# EAGLE design Devi (EAGLE 7.6.0)
CNAME: OffGrid-Devices Devi; CREVISION: B; DESIGNER: Tiago Angelo
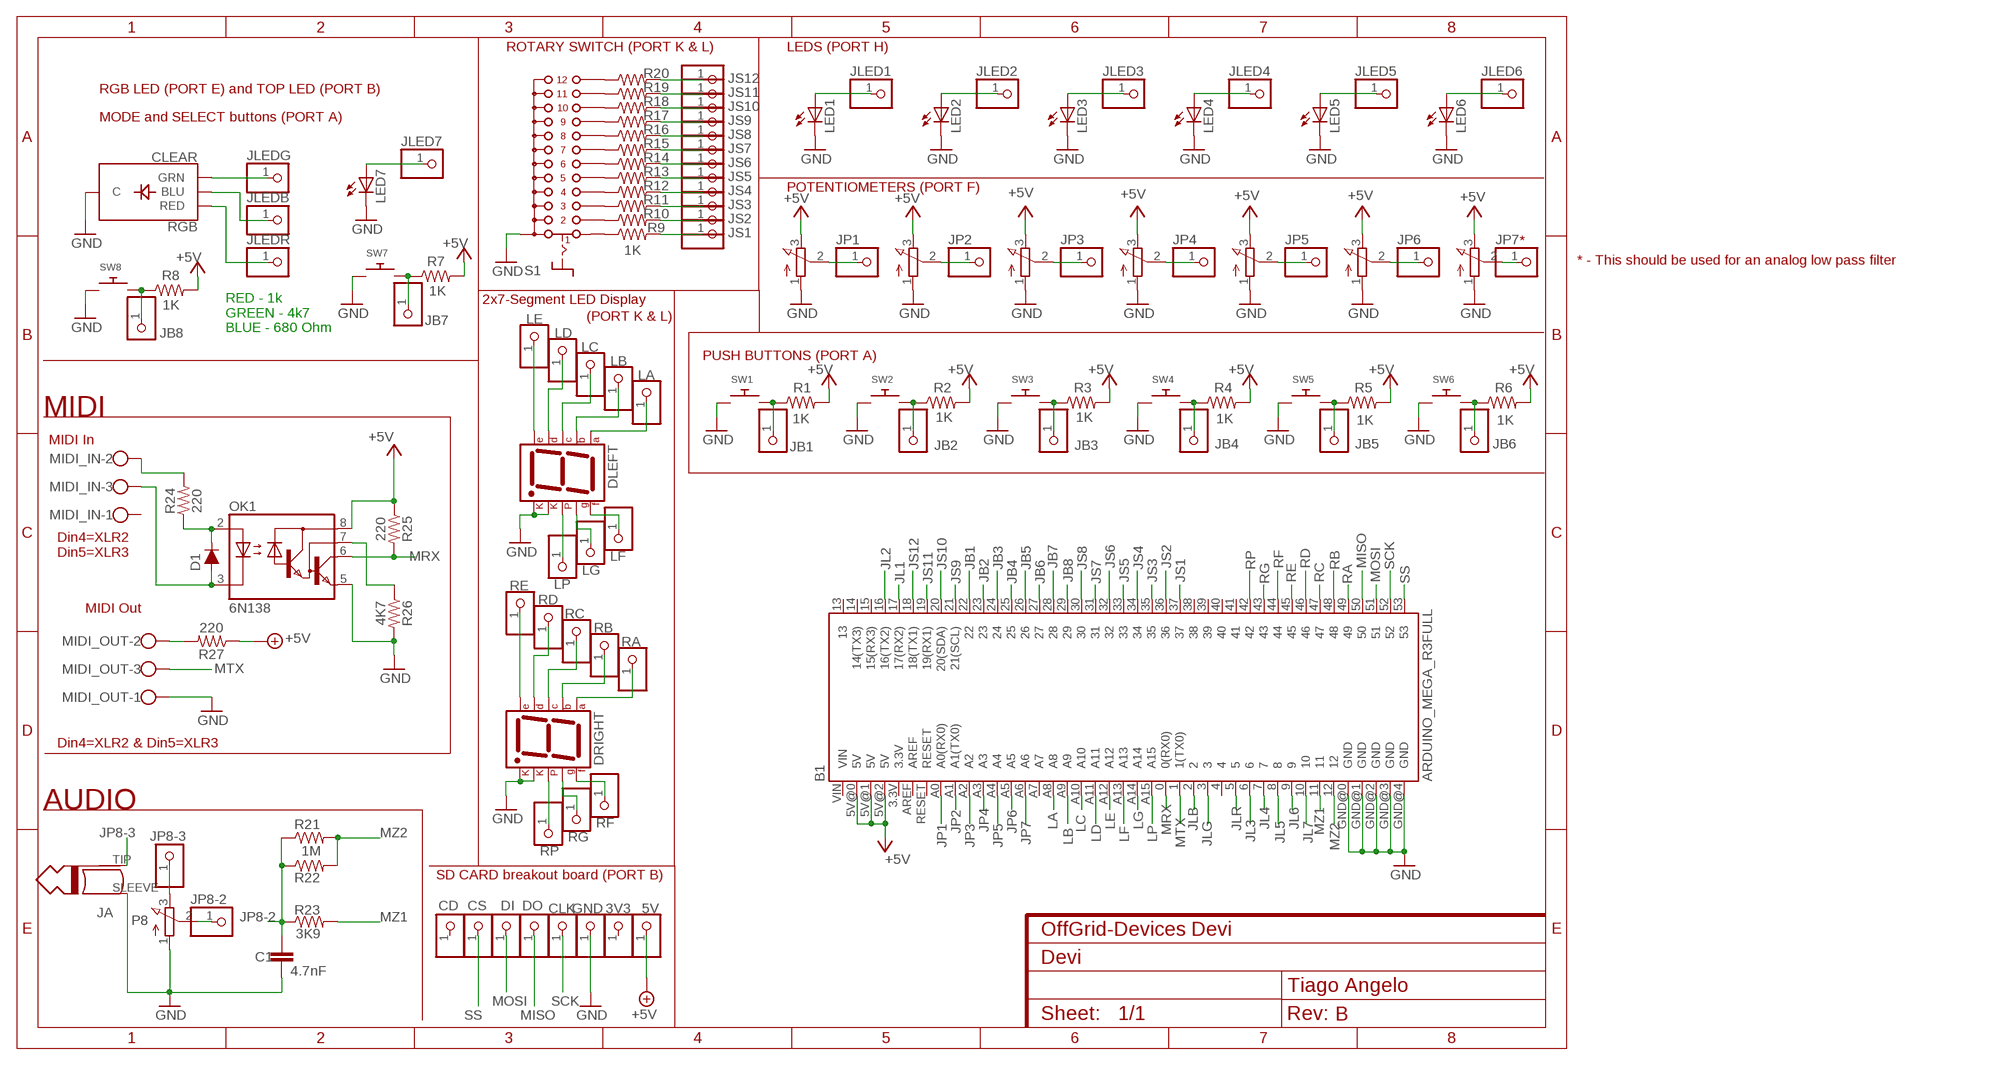
[diagram p0: schematic, sheet 1]

## Parts
3V3  PINHD-1X1CB  [1X01-CLEANBIG]
5V  PINHD-1X1CB  [1X01-CLEANBIG]
B1  ARDUINO_MEGA_R3FULL  [ARDUINO_MEGA]
C1  4.7nF  C-EU050-025X075  [C050-025X075]
CD  PINHD-1X1CB  [1X01-CLEANBIG]
CLK  PINHD-1X1CB  [1X01-CLEANBIG]
CS  PINHD-1X1CB  [1X01-CLEANBIG]
D1  200mA/100V/1V  DIODE-1N4148  [DIODE-1N4148]
DI  PINHD-1X1CB  [1X01-CLEANBIG]
DLEFT  7SEG-CK  [7SEG-13]
DO  PINHD-1X1CB  [1X01-CLEANBIG]
DRIGHT  7SEG-CK  [7SEG-13]
GND  PINHD-1X1CB  [1X01-CLEANBIG]
JA  MONO_PLUG  [TWO_PADS]
JB1  PINHD-1X1CB  [1X01-CLEANBIG]
JB2  PINHD-1X1CB  [1X01-CLEANBIG]
JB3  PINHD-1X1CB  [1X01-CLEANBIG]
JB4  PINHD-1X1CB  [1X01-CLEANBIG]
JB5  PINHD-1X1CB  [1X01-CLEANBIG]
JB6  PINHD-1X1CB  [1X01-CLEANBIG]
JB7  PINHD-1X1CB  [1X01-CLEANBIG]
JB8  PINHD-1X1CB  [1X01-CLEANBIG]
JLED1  PINHD-1X1CB  [1X01-CLEANBIG]
JLED2  PINHD-1X1CB  [1X01-CLEANBIG]
JLED3  PINHD-1X1CB  [1X01-CLEANBIG]
JLED4  PINHD-1X1CB  [1X01-CLEANBIG]
JLED5  PINHD-1X1CB  [1X01-CLEANBIG]
JLED6  PINHD-1X1CB  [1X01-CLEANBIG]
JLED7  PINHD-1X1CB  [1X01-CLEANBIG]
JLEDB  PINHD-1X1CB  [1X01-CLEANBIG]
JLEDG  PINHD-1X1CB  [1X01-CLEANBIG]
JLEDR  PINHD-1X1CB  [1X01-CLEANBIG]
JP1  PINHD-1X1CB  [1X01-CLEANBIG]
JP2  PINHD-1X1CB  [1X01-CLEANBIG]
JP3  PINHD-1X1CB  [1X01-CLEANBIG]
JP4  PINHD-1X1CB  [1X01-CLEANBIG]
JP5  PINHD-1X1CB  [1X01-CLEANBIG]
JP6  PINHD-1X1CB  [1X01-CLEANBIG]
JP7  PINHD-1X1CB  [1X01-CLEANBIG]
JP8-2  PINHD-1X1CB  [1X01-CLEANBIG]
JP8-3  PINHD-1X1CB  [1X01-CLEANBIG]
JS1  PINHD-1X1CB  [1X01-CLEANBIG]
JS2  PINHD-1X1CB  [1X01-CLEANBIG]
JS3  PINHD-1X1CB  [1X01-CLEANBIG]
JS4  PINHD-1X1CB  [1X01-CLEANBIG]
JS5  PINHD-1X1CB  [1X01-CLEANBIG]
JS6  PINHD-1X1CB  [1X01-CLEANBIG]
JS7  PINHD-1X1CB  [1X01-CLEANBIG]
JS8  PINHD-1X1CB  [1X01-CLEANBIG]
JS9  PINHD-1X1CB  [1X01-CLEANBIG]
JS10  PINHD-1X1CB  [1X01-CLEANBIG]
JS11  PINHD-1X1CB  [1X01-CLEANBIG]
JS12  PINHD-1X1CB  [1X01-CLEANBIG]
LA  PINHD-1X1CB  [1X01-CLEANBIG]
LB  PINHD-1X1CB  [1X01-CLEANBIG]
LC  PINHD-1X1CB  [1X01-CLEANBIG]
LD  PINHD-1X1CB  [1X01-CLEANBIG]
LE  PINHD-1X1CB  [1X01-CLEANBIG]
LED1  LED3MM  [LED3MM]
LED2  LED3MM  [LED3MM]
LED3  LED3MM  [LED3MM]
LED4  LED3MM  [LED3MM]
LED5  LED3MM  [LED3MM]
LED6  LED3MM  [LED3MM]
LED7  LED3MM  [LED3MM]
LF  PINHD-1X1CB  [1X01-CLEANBIG]
LG  PINHD-1X1CB  [1X01-CLEANBIG]
LP  PINHD-1X1CB  [1X01-CLEANBIG]
MIDI_IN  W237-103  [W237-103]
MIDI_OUT  W237-103  [W237-103]
OK1  6N138  [DIL08]
P1  3RP/1610N  [3RP/1610N]
P2  3RP/1610N  [3RP/1610N]
P3  3RP/1610N  [3RP/1610N]
P4  3RP/1610N  [3RP/1610N]
P5  3RP/1610N  [3RP/1610N]
P6  3RP/1610N  [3RP/1610N]
P7  3RP/1610N  [3RP/1610N]
P8  3RP/1610N  [3RP/1610N]
R1  1K  1KOHM-HORIZ-1/4W-5%  [AXIAL-0.3]
R2  1K  1KOHM-HORIZ-1/4W-5%  [AXIAL-0.3]
R3  1K  1KOHM-HORIZ-1/4W-5%  [AXIAL-0.3]
R4  1K  1KOHM-HORIZ-1/4W-5%  [AXIAL-0.3]
R5  1K  1KOHM-HORIZ-1/4W-5%  [AXIAL-0.3]
R6  1K  1KOHM-HORIZ-1/4W-5%  [AXIAL-0.3]
R7  1K  1KOHM-HORIZ-1/4W-5%  [AXIAL-0.3]
R8  1K  1KOHM-HORIZ-1/4W-5%  [AXIAL-0.3]
R9  1K  1KOHM-HORIZ-1/4W-5%  [AXIAL-0.3]
R10  1K  1KOHM-HORIZ-1/4W-5%  [AXIAL-0.3]
R11  1K  1KOHM-HORIZ-1/4W-5%  [AXIAL-0.3]
R12  1K  1KOHM-HORIZ-1/4W-5%  [AXIAL-0.3]
R13  1K  1KOHM-HORIZ-1/4W-5%  [AXIAL-0.3]
R14  1K  1KOHM-HORIZ-1/4W-5%  [AXIAL-0.3]
R15  1K  1KOHM-HORIZ-1/4W-5%  [AXIAL-0.3]
R16  1K  1KOHM-HORIZ-1/4W-5%  [AXIAL-0.3]
R17  1K  1KOHM-HORIZ-1/4W-5%  [AXIAL-0.3]
R18  1K  1KOHM-HORIZ-1/4W-5%  [AXIAL-0.3]
R19  1K  1KOHM-HORIZ-1/4W-5%  [AXIAL-0.3]
R20  1K  1KOHM-HORIZ-1/4W-5%  [AXIAL-0.3]
R21  1M  1KOHM-HORIZ-1/4W-5%  [AXIAL-0.3]
R22  1M  1KOHM-HORIZ-1/4W-5%  [AXIAL-0.3]
R23  3K9  1KOHM-HORIZ-1/4W-5%  [AXIAL-0.3]
R24  220  1KOHM-HORIZ-1/4W-5%  [AXIAL-0.3]
R25  220  1KOHM-HORIZ-1/4W-5%  [AXIAL-0.3]
R26  4K7  1KOHM-HORIZ-1/4W-5%  [AXIAL-0.3]
R27  220  1KOHM-HORIZ-1/4W-5%  [AXIAL-0.3]
RA  PINHD-1X1CB  [1X01-CLEANBIG]
RB  PINHD-1X1CB  [1X01-CLEANBIG]
RC  PINHD-1X1CB  [1X01-CLEANBIG]
RD  PINHD-1X1CB  [1X01-CLEANBIG]
RE  PINHD-1X1CB  [1X01-CLEANBIG]
RF  PINHD-1X1CB  [1X01-CLEANBIG]
RG  PINHD-1X1CB  [1X01-CLEANBIG]
RGB  CLEAR  LED-RGB-CCCLEAR  [LED-RGB-THRU]
RP  PINHD-1X1CB  [1X01-CLEANBIG]
S1  CK101X12  [CK101X12]
SW1  SWITCH_PUSHBUTTONEVQ-PE  [TACT_PANA-EVQ]
SW2  SWITCH_PUSHBUTTONEVQ-PE  [TACT_PANA-EVQ]
SW3  SWITCH_PUSHBUTTONEVQ-PE  [TACT_PANA-EVQ]
SW4  SWITCH_PUSHBUTTONEVQ-PE  [TACT_PANA-EVQ]
SW5  SWITCH_PUSHBUTTONEVQ-PE  [TACT_PANA-EVQ]
SW6  SWITCH_PUSHBUTTONEVQ-PE  [TACT_PANA-EVQ]
SW7  SWITCH_PUSHBUTTONEVQ-PE  [TACT_PANA-EVQ]
SW8  SWITCH_PUSHBUTTONEVQ-PE  [TACT_PANA-EVQ]

## Nets
+5V: 5V.1 B1.5V@0(5V) B1.5V@1(5V) B1.5V@2(5V) OK1.8(VCC) P1.3(E) P2.3(E) P3.3(E) P4.3(E) P5.3(E) P6.3(E) P7.3(E) R1.P$2 R2.P$2 R3.P$2 R4.P$2 R5.P$2 R6.P$2 R7.P$2 R8.P$2 R25.P$1 R27.P$1
GND: B1.GND@0(GND) B1.GND@1(GND) B1.GND@2(GND) B1.GND@3(GND) B1.GND@4(GND) C1.2 DLEFT.3(CK1) DLEFT.8(CK2) DRIGHT.3(CK1) DRIGHT.8(CK2) GND.1 JA.SLEEVE LED1.K(C) LED2.K(C) LED3.K(C) LED4.K(C) LED5.K(C) LED6.K(C) LED7.K(C) MIDI_OUT.1 OK1.5(GND) P1.1(A) P2.1(A) P3.1(A) P4.1(A) P5.1(A) P6.1(A) P7.1(A) P8.1(A) R26.P$2 RGB.2(C) S1.A SW1.P$1 SW2.P$1 SW3.P$1 SW4.P$1 SW5.P$1 SW6.P$1 SW7.P$1 SW8.P$1
JB1: B1.22 JB1.1 R1.P$1 SW1.P$2
JB2: B1.23 JB2.1 R2.P$1 SW2.P$2
JB3: B1.24 JB3.1 R3.P$1 SW3.P$2
JB4: B1.25 JB4.1 R4.P$1 SW4.P$2
JB5: B1.26 JB5.1 R5.P$1 SW5.P$2
JB6: B1.27 JB6.1 R6.P$1 SW6.P$2
JB7: B1.28 JB7.1 R7.P$1 SW7.P$2
JB8: B1.29 JB8.1 R8.P$1 SW8.P$2
JL1: B1.17(17(RX2)) JLED1.1 LED1.A
JL2: B1.16(16(TX2)) JLED2.1 LED2.A
JL3: B1.6 JLED3.1 LED3.A
JL4: B1.7 JLED4.1 LED4.A
JL5: B1.8 JLED5.1 LED5.A
JL6: B1.9 JLED6.1 LED6.A
JL7: B1.10 JLED7.1 LED7.A
JLB: B1.2 JLEDB.1 RGB.4(BLU)
JLG: B1.3 JLEDG.1 RGB.3(GRN)
JLR: B1.5 JLEDR.1 RGB.1(RED)
JP1: B1.A0(A0(RX0)) JP1.1 P1.2(S)
JP2: B1.A1(A1(TX0)) JP2.1 P2.2(S)
JP3: B1.A2 JP3.1 P3.2(S)
JP4: B1.A3 JP4.1 P4.2(S)
JP5: B1.A4 JP5.1 P5.2(S)
JP6: B1.A5 JP6.1 P6.2(S)
JP7: B1.A6 JP7.1 P7.2(S)
JP8-2: C1.1 JP8-2.1 P8.2(S) R21.P$1 R22.P$1 R23.P$1
JP8-3: JA.TIP JP8-3.1 P8.3(E)
JS1: B1.37 JS1.1 R9.P$2
JS2: B1.36 JS2.1 R10.P$2
JS3: B1.35 JS3.1 R11.P$2
JS4: B1.34 JS4.1 R12.P$2
JS5: B1.33 JS5.1 R13.P$2
JS6: B1.32 JS6.1 R14.P$2
JS7: B1.31 JS7.1 R15.P$2
JS8: B1.30 JS8.1 R16.P$2
JS9: B1.21(21(SCL)) JS9.1 R17.P$2
JS10: B1.20(20(SDA)) JS10.1 R18.P$2
JS11: B1.19(19(RX1)) JS11.1 R19.P$2
JS12: B1.18(18(TX1)) JS12.1 R20.P$2
LA: B1.A8 DLEFT.7(A) LA.1
LB: B1.A9 DLEFT.6(B) LB.1
LC: B1.A10 DLEFT.4(C) LC.1
LD: B1.A11 DLEFT.2(D) LD.1
LE: B1.A12 DLEFT.1(E) LE.1
LF: B1.A13 DLEFT.9(F) LF.1
LG: B1.A14 DLEFT.10(G) LG.1
LP: B1.A15 DLEFT.5(DP) LP.1
MISO: B1.50 DO.1
MOSI: B1.51 DI.1
MRX: B1.0(0(RX0)) OK1.6(VO) R25.P$2
MTX: B1.1(1(TX0)) MIDI_OUT.3
MZ1: B1.11 R23.P$2
MZ2: B1.12 R21.P$2 R22.P$2
N$2: R9.P$1 S1.1
N$3: R10.P$1 S1.2
N$4: R11.P$1 S1.3
N$5: R12.P$1 S1.4
N$6: R13.P$1 S1.5
N$7: R14.P$1 S1.6
N$8: R15.P$1 S1.7
N$9: R16.P$1 S1.8
N$10: R17.P$1 S1.9
N$11: R18.P$1 S1.10
N$12: R19.P$1 S1.11
N$13: R20.P$1 S1.12
N$25: D1.A MIDI_IN.3 OK1.3(C)
N$28: D1.C OK1.2(A) R24.P$1
N$29: MIDI_IN.2 R24.P$2
N$30: OK1.7(VB) R26.P$1
N$31: MIDI_OUT.2 R27.P$2
RA: B1.49 DRIGHT.7(A) RA.1
RB: B1.48 DRIGHT.6(B) RB.1
RC: B1.47 DRIGHT.4(C) RC.1
RD: B1.46 DRIGHT.2(D) RD.1
RE: B1.45 DRIGHT.1(E) RE.1
RF: B1.44 DRIGHT.9(F) RF.1
RG: B1.43 DRIGHT.10(G) RG.1
RP: B1.42 DRIGHT.5(DP) RP.1
SCK: B1.52 CLK.1
SS: B1.53 CS.1
Unconnected: 3V3.1 B1.3.3V B1.4 B1.13 B1.14(14(TX3)) B1.15(15(RX3)) B1.38 B1.39 B1.40 B1.41 B1.A7 B1.AREF B1.RESET B1.VIN CD.1 MIDI_IN.1

## Notes on the sheet
- ROTARY SWITCH (PORT K & L) | LEDS (PORT H)
- RGB LED (PORT E) and TOP LED (PORT B)
- MODE and SELECT buttons (PORT A)
- POTENTIOMETERS (PORT F)
- *
- * - This should be used for an analog low pass filter
- 2x7-Segment LED Display
- (PORT K & L)
- RED - 1k
  GREEN - 4k7 
  BLUE - 680 Ohm
- PUSH BUTTONS (PORT A)
- MIDI
- MIDI In
- Din4=XLR2 
  Din5=XLR3
- MIDI Out
- Din4=XLR2 & Din5=XLR3
- AUDIO
- SD CARD breakout board (PORT B)

## Library data of the parts
3V3 5V CD CLK CS DI DO GND JB1-JB8 JLED1-JLED7 JLEDB JLEDG JLEDR JP1-JP7 JP8-2 JP8-3 JS1-JS12 LA LB LC LD LE LF LG LP RA RB RC RD RE RF RG RP = adafruit:PINHD-1X1: Pin header 1x1 for 0.1" spacing With round pins
B1 = offgrid-devices:ARDUINO_MEGA_R3: Arduino Mega R3 ATmega2560 R3 compatible footprint. SparkFun Products: Arduino Mega 2560 R3 <https://www.sparkfun.com/products/11061>
C1 = rcl:C-EU: CAPACITOR, European symbol
D1 = SparkFun-DiscreteSemi:DIODE: Diode These are standard reverse protection diodes and small signal diodes. SparkFun Products: SparkFun SparkPunk Sound Kit <https://www.sparkfun.com/products/11177> SparkFun ESP8266 Thing <https://www.sparkfun.com/products/13231>; PROD_ID: DIO-08378
DLEFT DRIGHT = special:7SEG-CK: 7-segment DISPLAY single cathode, 13 mm
JA = gm-jacks:MONO_PLUG
LED1-LED7 = led:LED: LED OSRAM: - CHIPLED LG R971, LG N971, LY N971, LG Q971, LY Q971, LO R971, LY R971 LH N974, LH R974 LS Q976, LO Q976, LY Q976 LO Q996 - Hyper CHIPLED LW Q18S LB Q993, LB Q99A, LB R99A - SideLED LS A670, LO A670, LY A670, LG A670, LP A670 LB A673, LV A673, LT A673, LW A673 LH A674 LY A675 LS A676, LA A676, LO A676, LY A676, LW A676 LS A679, LY A679, LG A679 - Hyper Micro SIDELED® LS Y876, LA Y876, LO Y876, LY Y876 LT Y87S - SmartLED LW L88C, LW L88S LB L89C, LB L89S, LG L890 LS L89K, LO L89K, LY L89K LS L896, LA L896, LO L896, LY L896 - TOPLED LS T670, LO T670, LY T670, LG T670, LP T670 LSG T670, LSP T670, LSY T670, LOP T670, LYG T670 LG T671, LOG T671, LSG T671 LB T673, LV T673, LT T673, LW T673 LH T674 LS T676, LA T676, LO T676, LY T676, LB T676, LH T676, LSB T676, LW T676 LB T67C, LV T67C, LT T67C, LS T67K, LO T67K, LY T67K, LW E67C LS E67B, LA E67B, LO E67B, LY E67B, LB E67C, LV E67C, LT E67C LW T67C LS T679, LY T679, LG T679 LS T770, LO T770, LY T770, LG T770, LP T770 LB T773, LV T773, LT T773, LW T773 LH T774 LS E675, LA E675, LY E675, LS T675 LS T776, LA T776, LO T776, LY T776, LB T776 LHGB T686 LT T68C, LB T68C - Hyper Mini TOPLED® LB M676 - Mini TOPLED Santana® LG M470 LS M47K, LO M47K, LY M47K Source: http://www.osram.convergy.de LUXEON: - LUMILED® LXK2-PW12-R00, LXK2-PW12-S00, LXK2-PW14-U00, LXK2-PW14-V00 LXK2-PM12-R00, LXK2-PM12-S00, LXK2-PM14-U00 LXK2-PE12-Q00, LXK2-PE12-R00, LXK2-PE12-S00, LXK2-PE14-T00, LXK2-PE14-U00 LXK2-PB12-K00, LXK2-PB12-L00, LXK2-PB12-M00, LXK2-PB14-N00, LXK2-PB14-P00, LXK2-PB14-Q00 LXK2-PR12-L00, LXK2-PR12-M00, LXK2-PR14-Q00, LXK2-PR14-R00 LXK2-PD12-Q00, LXK2-PD12-R00, LXK2-PD12-S00 LXK2-PH12-R00, LXK2-PH12-S00 LXK2-PL12-P00, LXK2-PL12-Q00, LXK2-PL12-R00 Source: www.luxeon.com KINGBRIGHT: KA-3528ASYC Source: www.kingbright.com
MIDI_IN MIDI_OUT = con-wago-500:W237-103: WAGO SCREW CLAMP; MPN: 237-103; OC_FARNELL: unknown; OC_NEWARK: 18M7116
OK1 = optocoupler:6N138: MOTOROLA OPTO COUPLER; MF: VISHAY/TELEFUNKEN; MPN: 6N138; OC_FARNELL: 9860150; OC_NEWARK: 35K5294
P1-P8 = pot:3RP/1610N: 16mm Potentiometer one level Source: http://www.alphapotentiometers.net/html/16mm_pot_2.html
R1-R27 = SparkFun-Resistors:1KOHM: 1kΩ resistor A resistor is a passive two-terminal electrical component that implements electrical resistance as a circuit element. Resistors act to reduce current flow, and, at the same time, act to lower voltage levels within circuits. - Wikipedia; PROD_ID: RES-08380; VALUE: 1k
RGB = SparkFun-LED:LED-RGB-CC: LED-RGB Common Cathode Packages: LED RGB-THRU LED_PIRANHA_5MM SparkFun Products: RGB Diffused Common Cathode- Diffuse <[https://www.sparkfun.com/products/9264]> RGB Diffused Common Cathode - Clear <[https://www.sparkfun.com/products/105]> LED-RGB 5mm Square (Piranha) <[https://www.sparkfun.com/products/11679]>; PROD_ID: DIO-08418
S1 = switch:CK101X12: ROTARY SWITCH C&K
SW1-SW8 = adafruit:SWITCH_PUSHBUTTON: Buttons SOFTTOUCHSMD_SJ - Soft touch temporary push button (Super Junk Akihabara) Compatible with SKPMANE010 [Mouser: 688-SKPMAN] C&K_KSS = Digikey: KSS221GLFS

## Net classes
0 default: width 0.508 mm, drill 0.508 mm, clearance 0.406 mm
1 GND: width 1.016 mm, drill 0.508 mm, clearance 0.508 mm

## Board
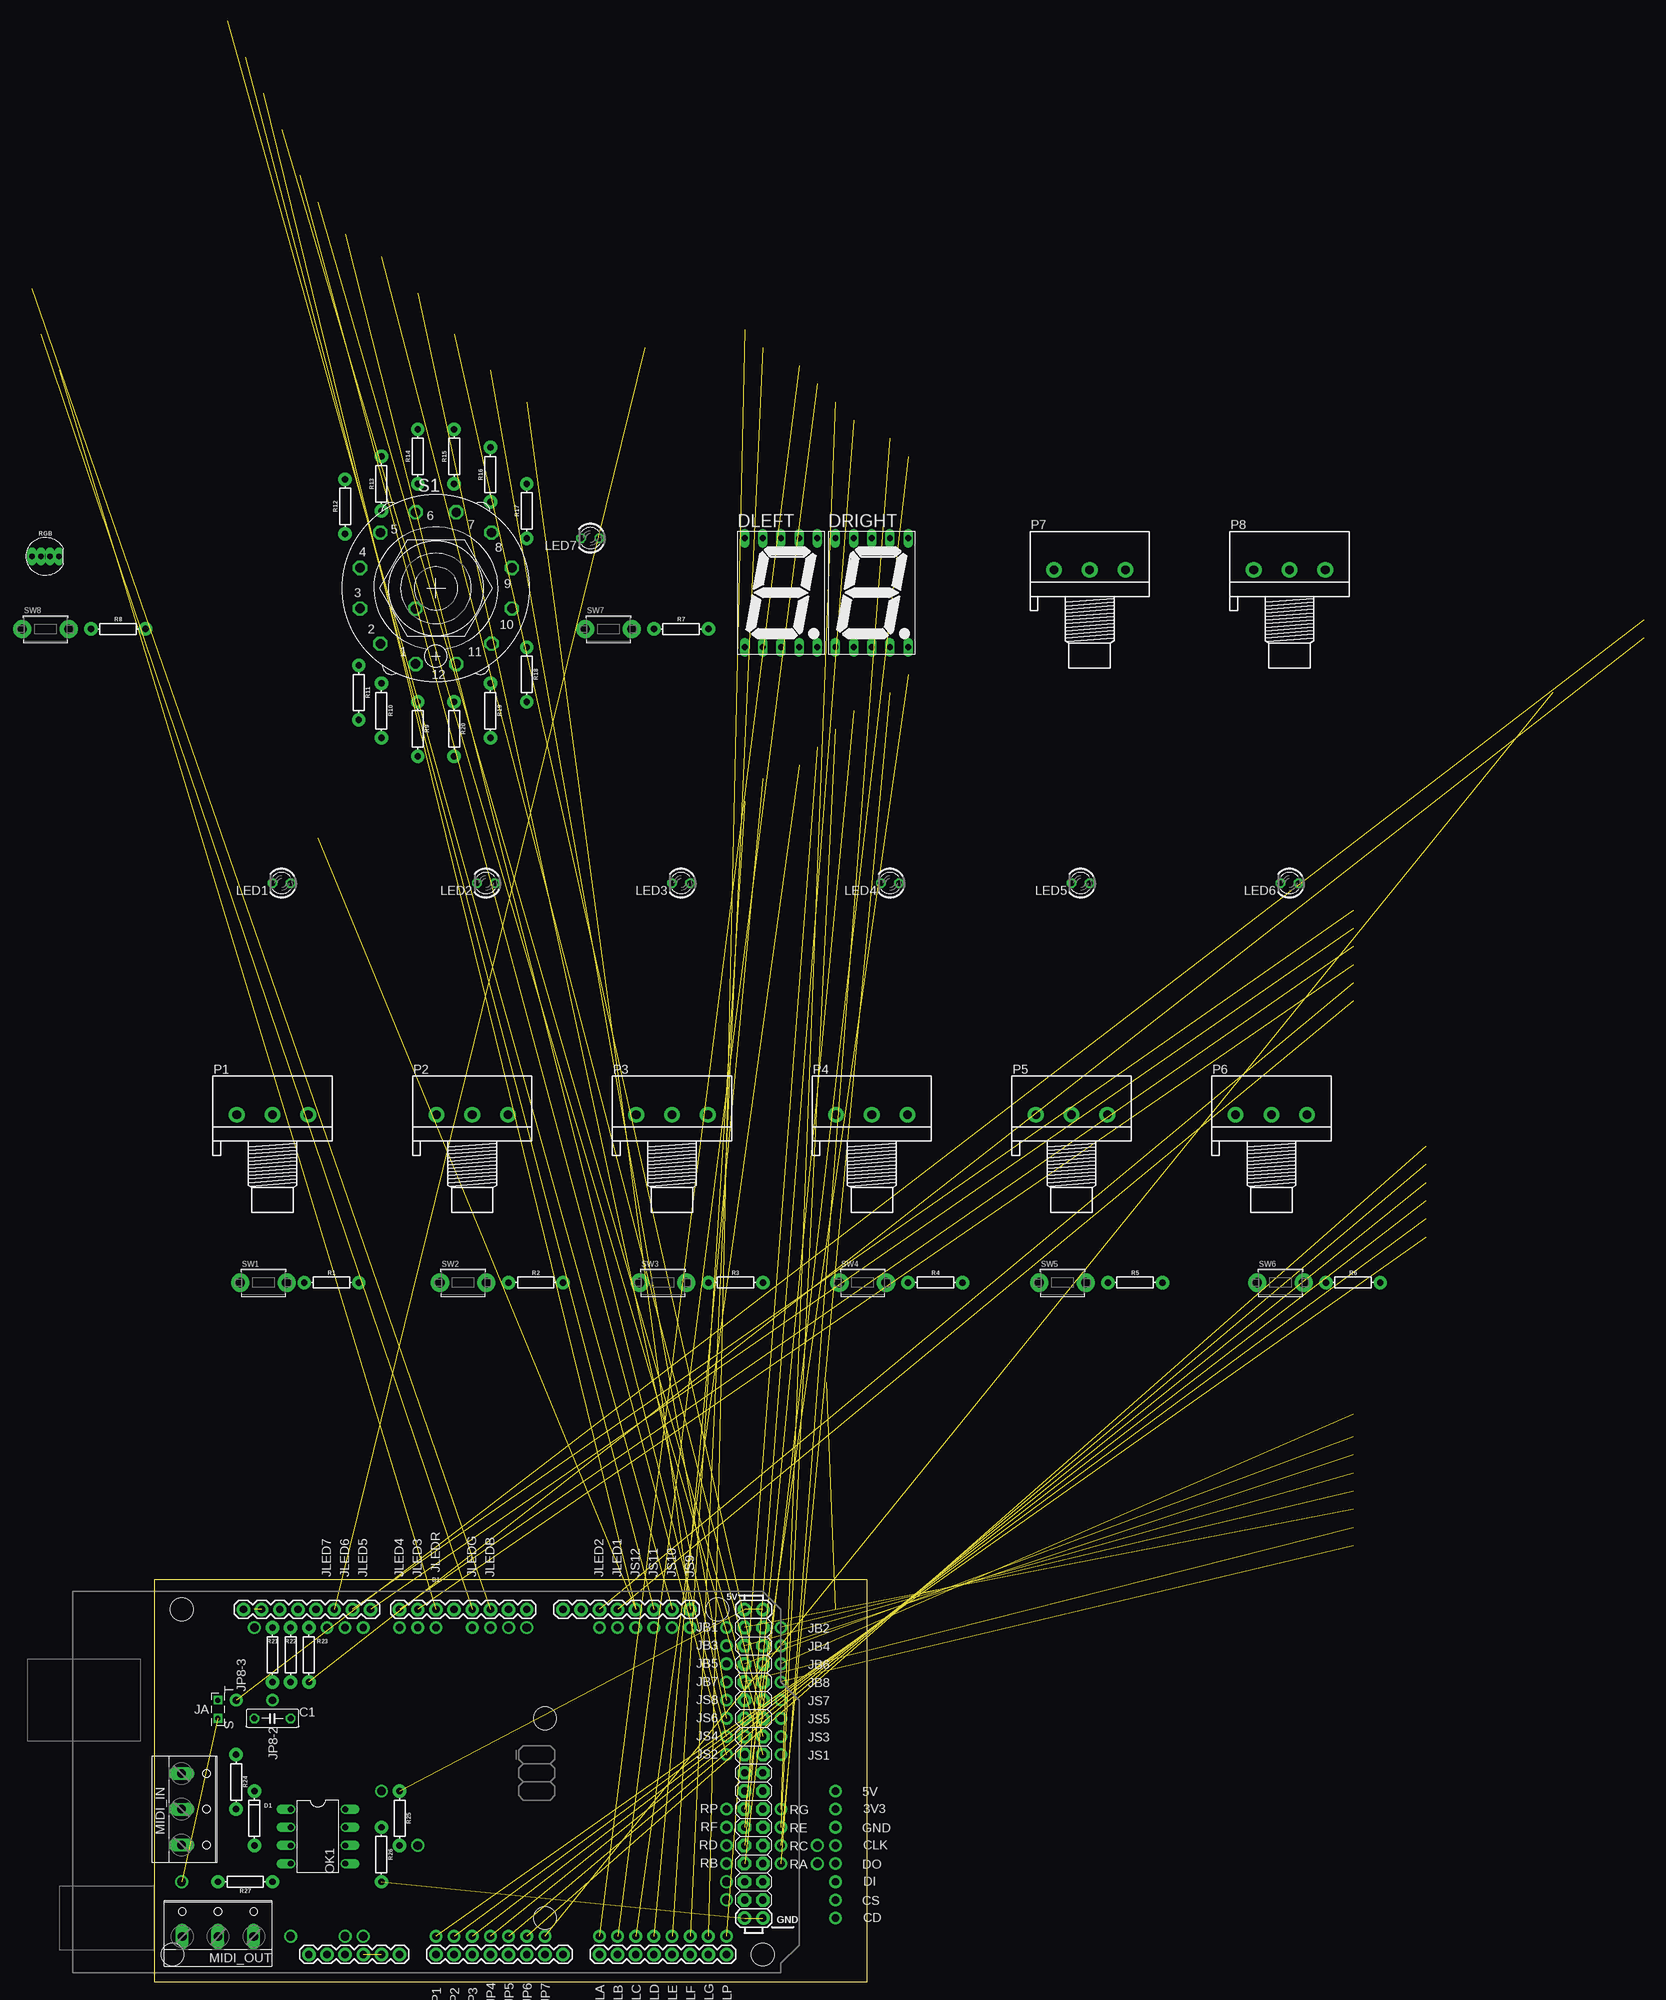
[diagram p1: board, top side]
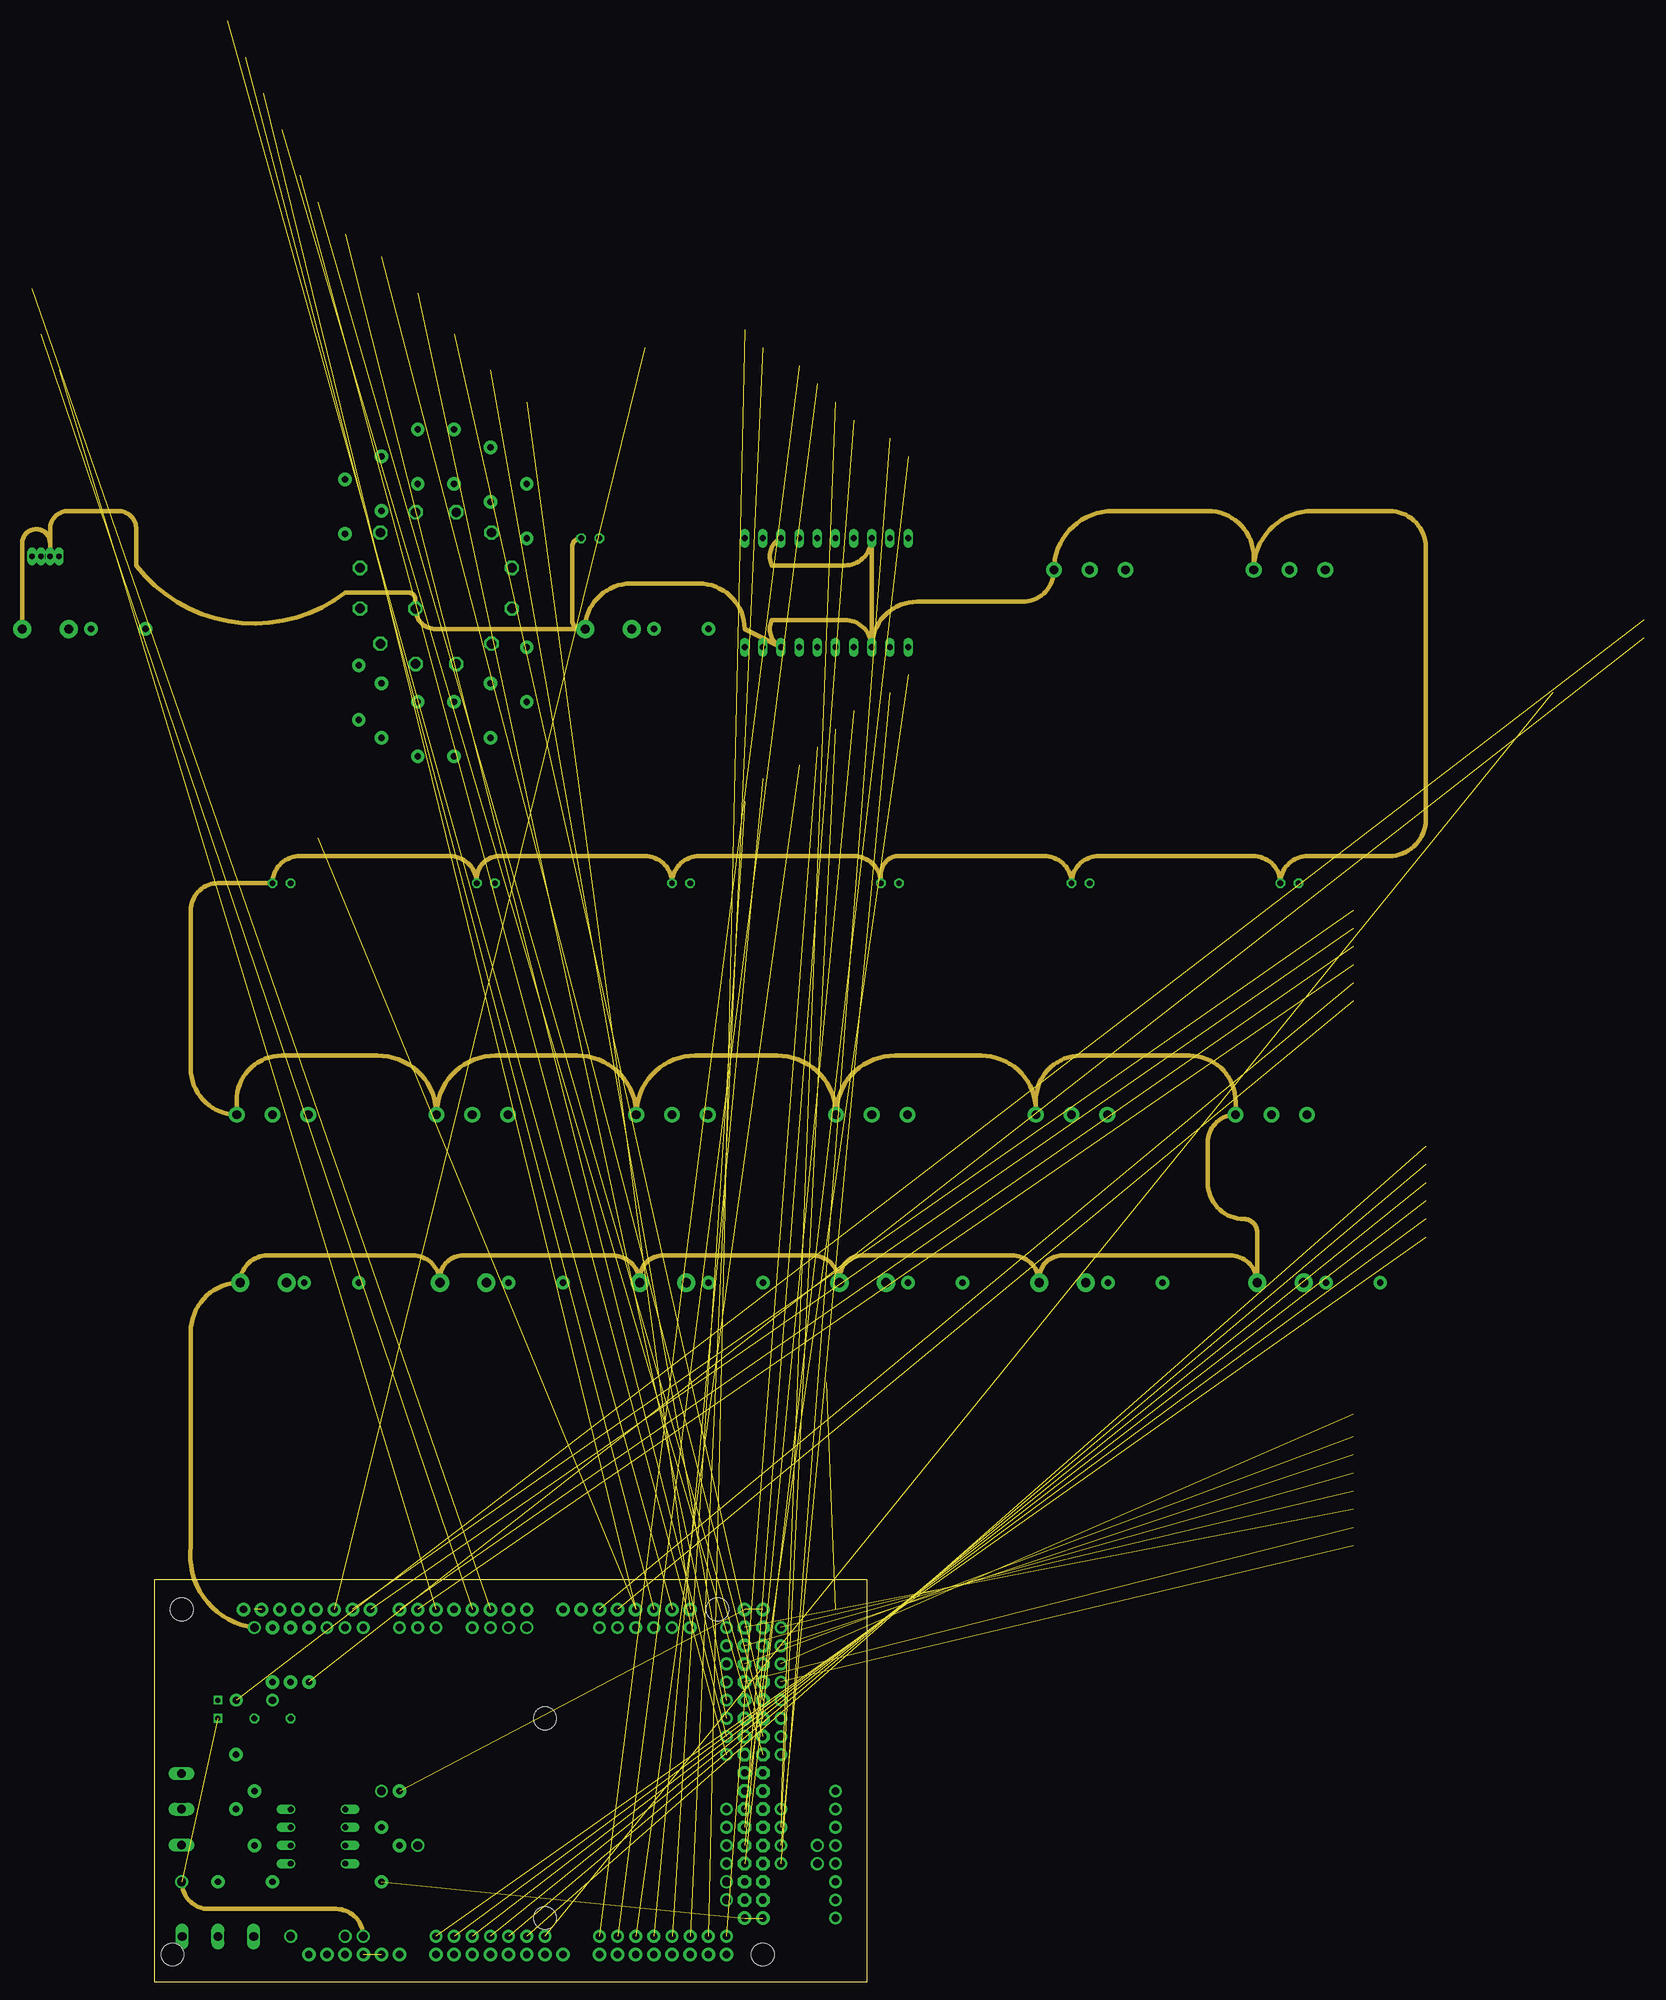
[diagram p2: board, inner layer Ground]
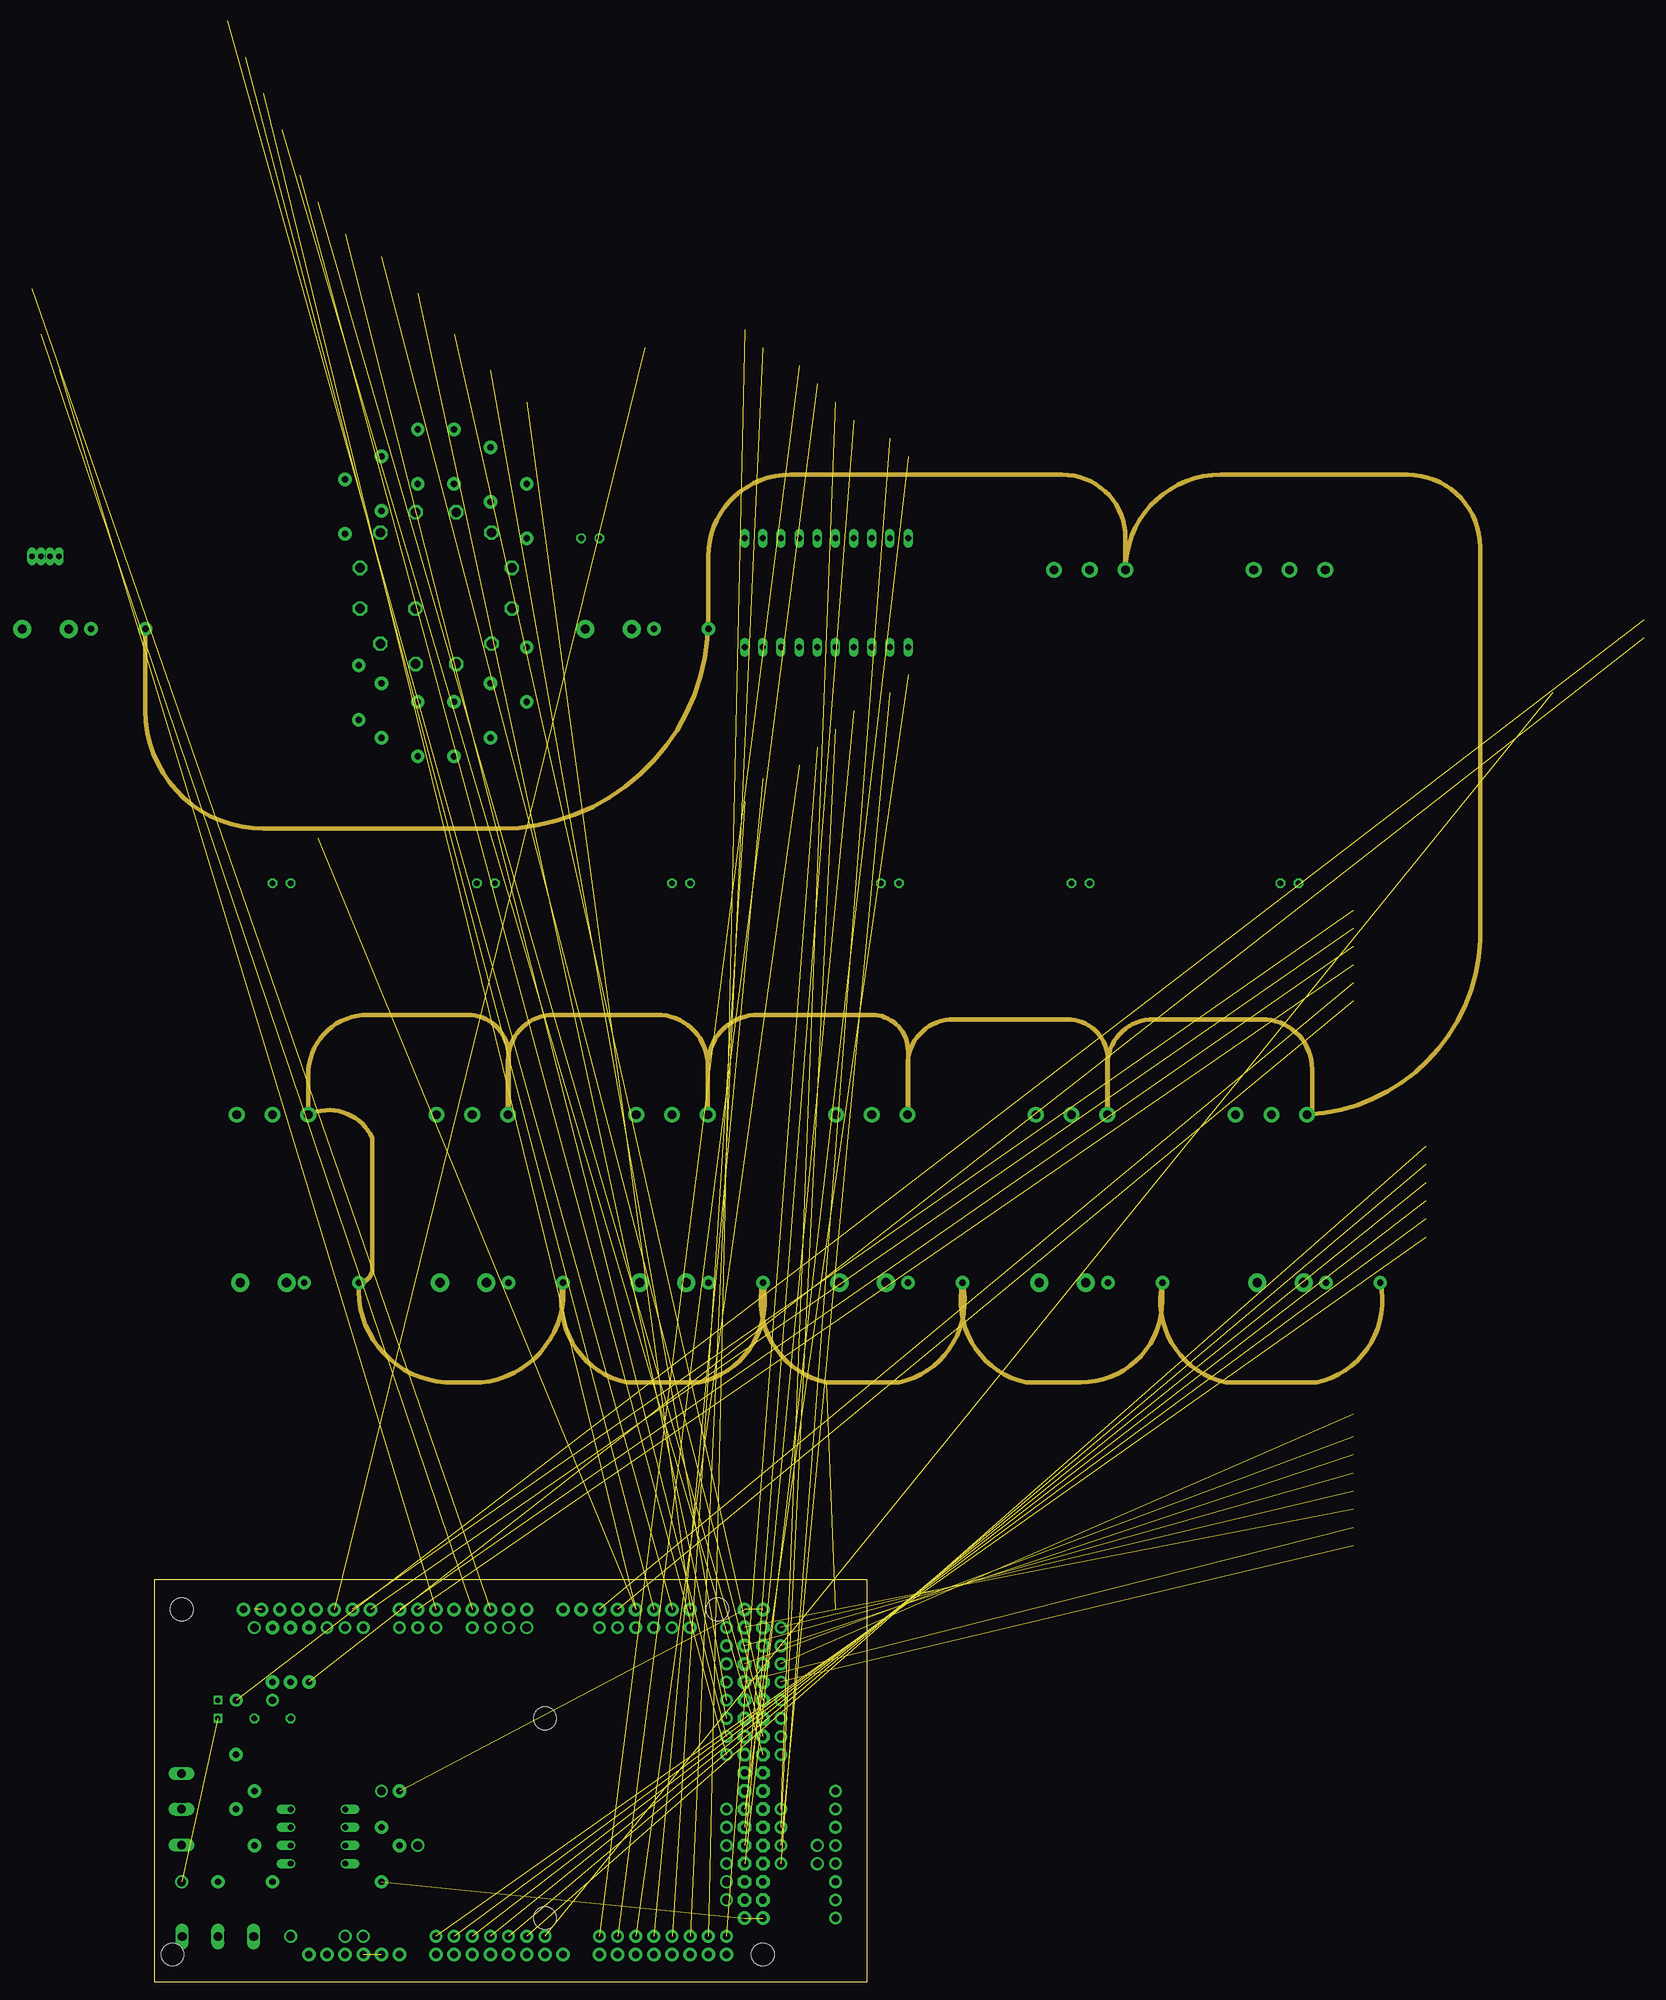
[diagram p3: board, inner layer 5V]
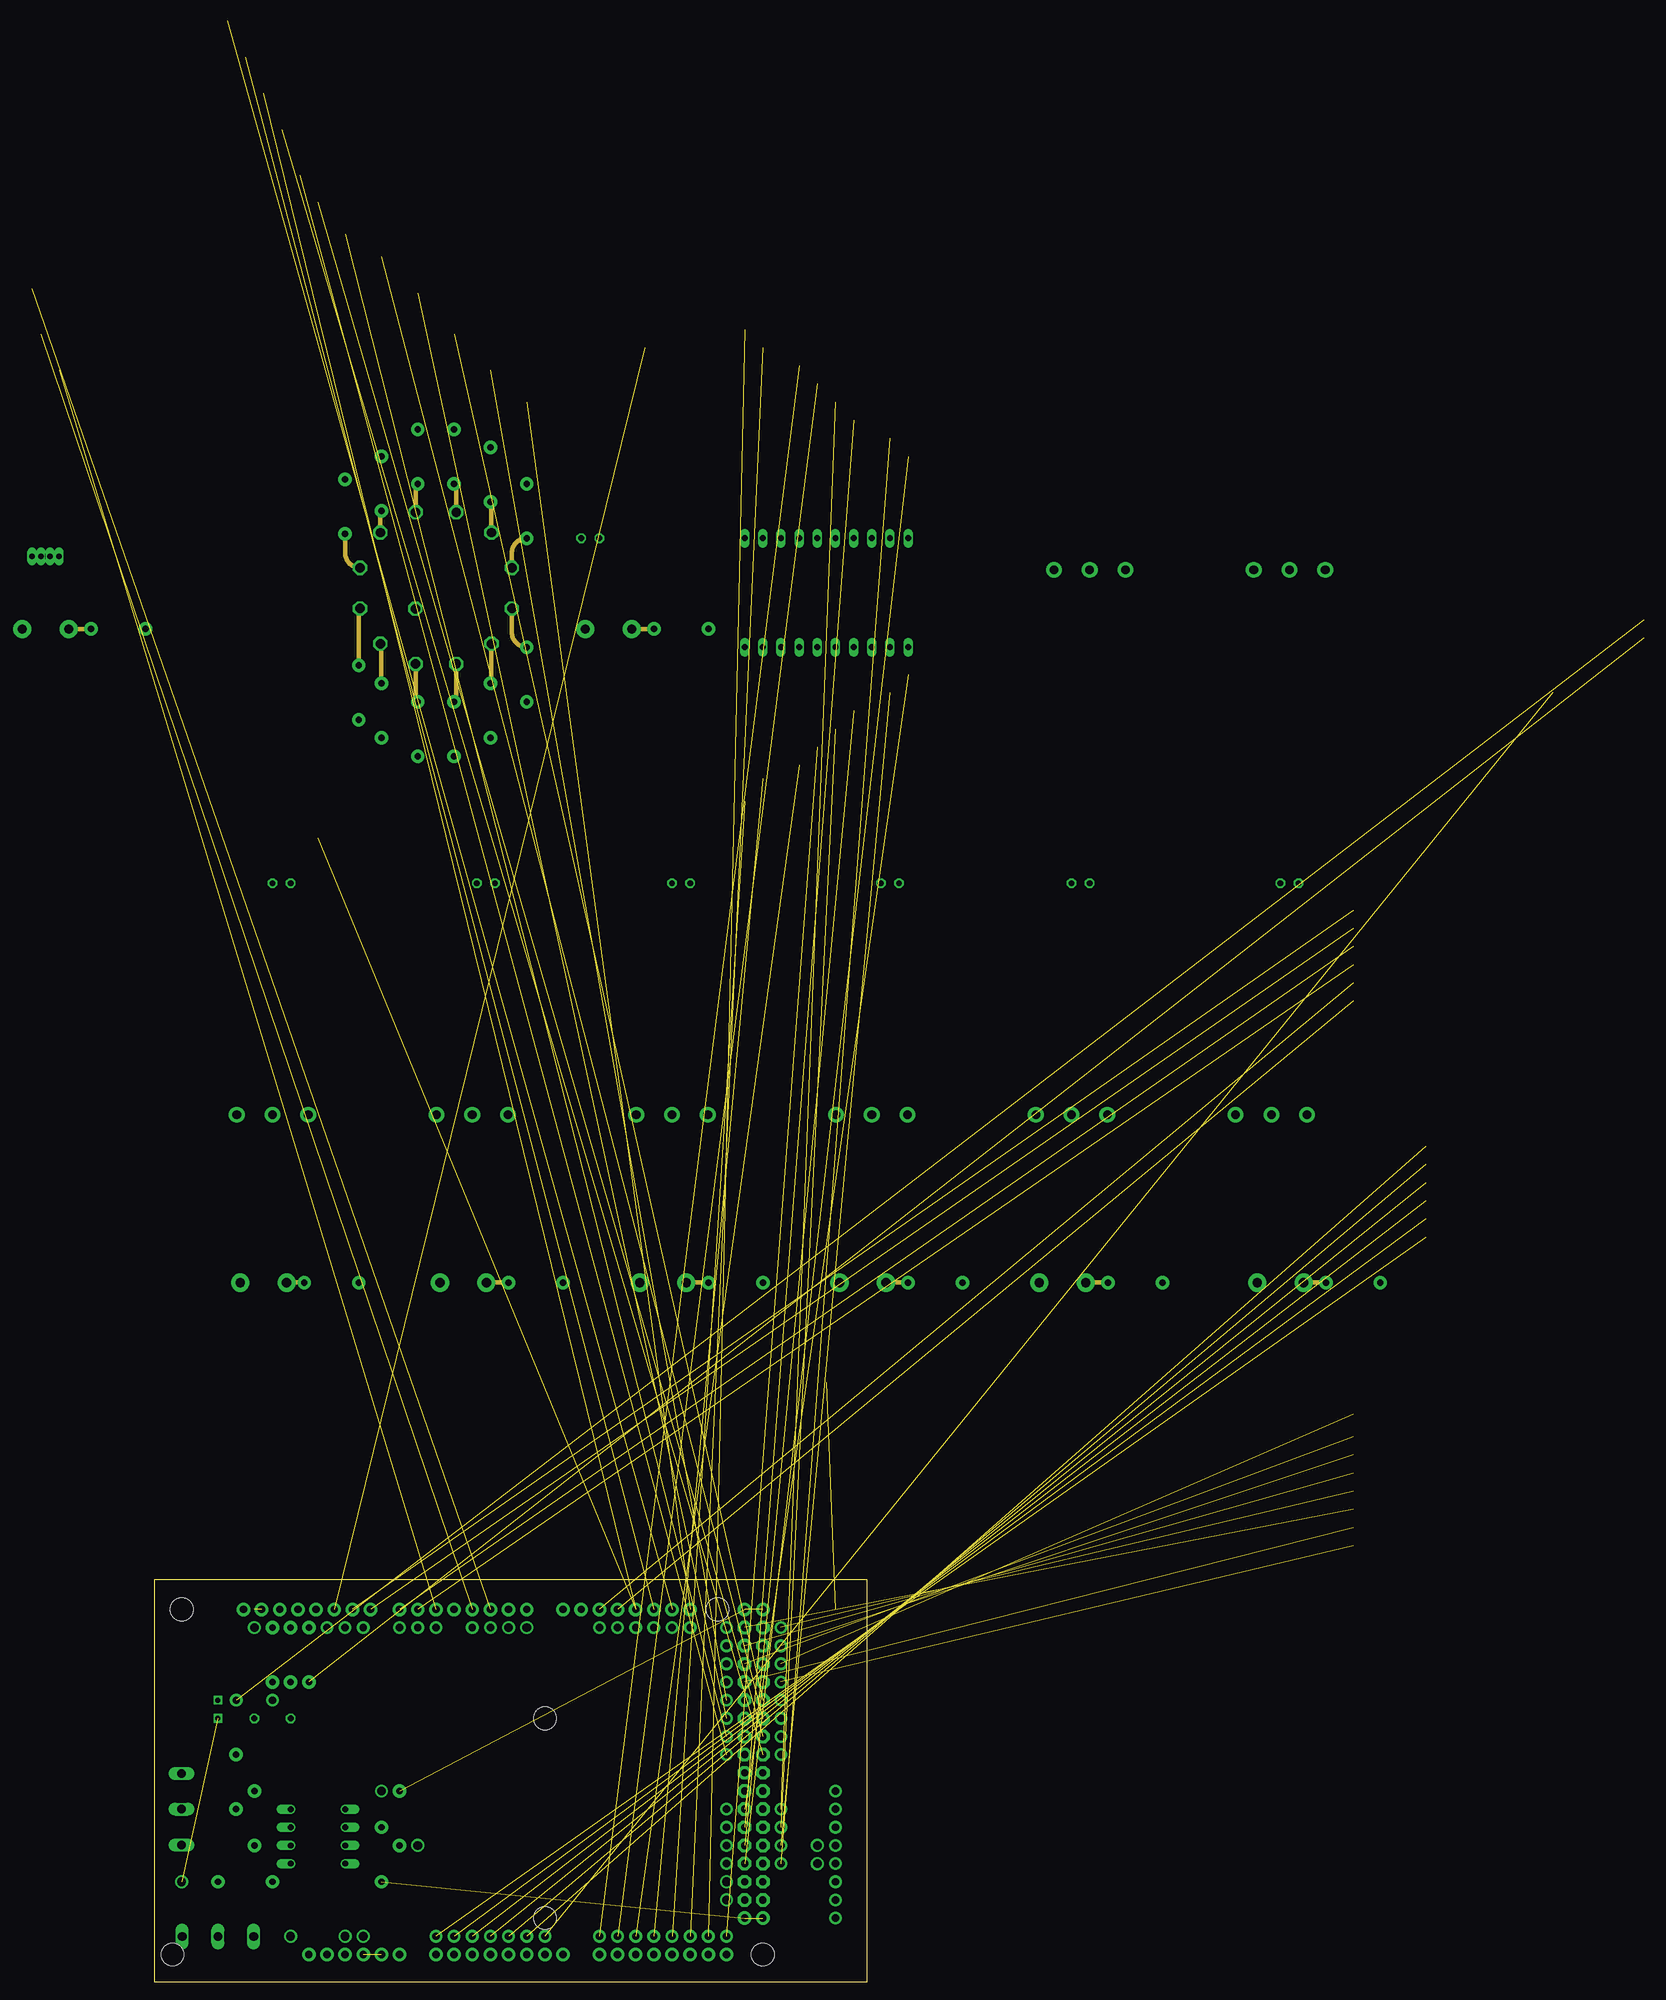
[diagram p4: board, inner layer SolderOnComponent]
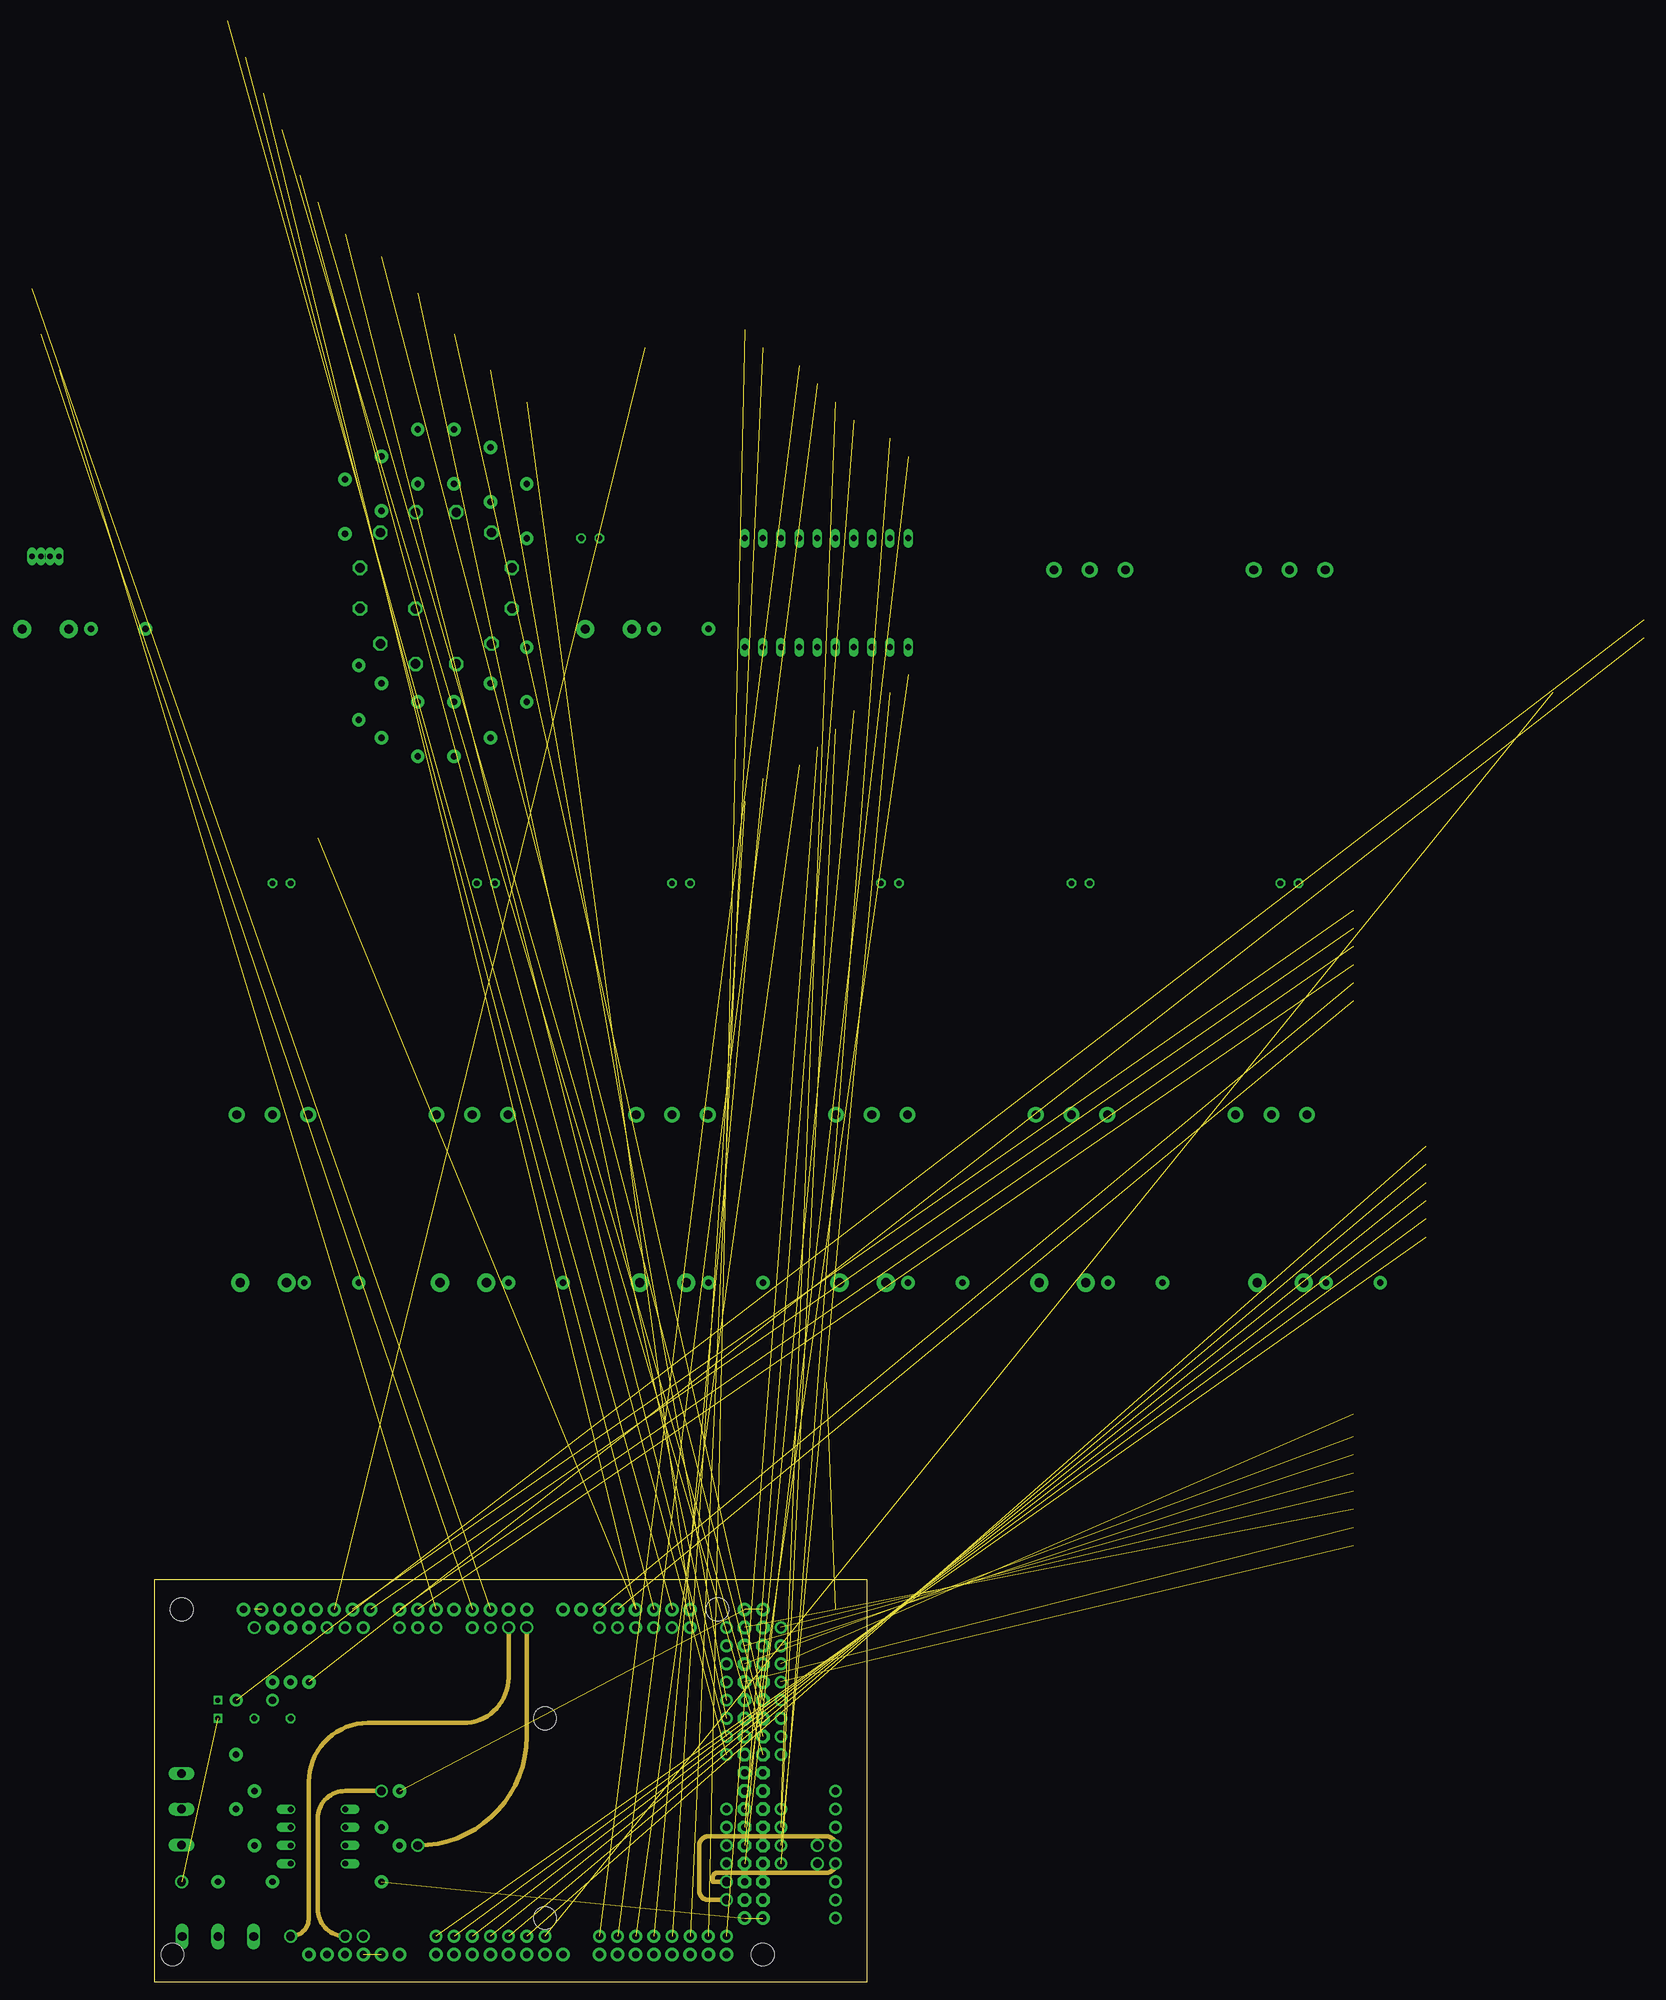
[diagram p5: board, inner layer BoardWire]
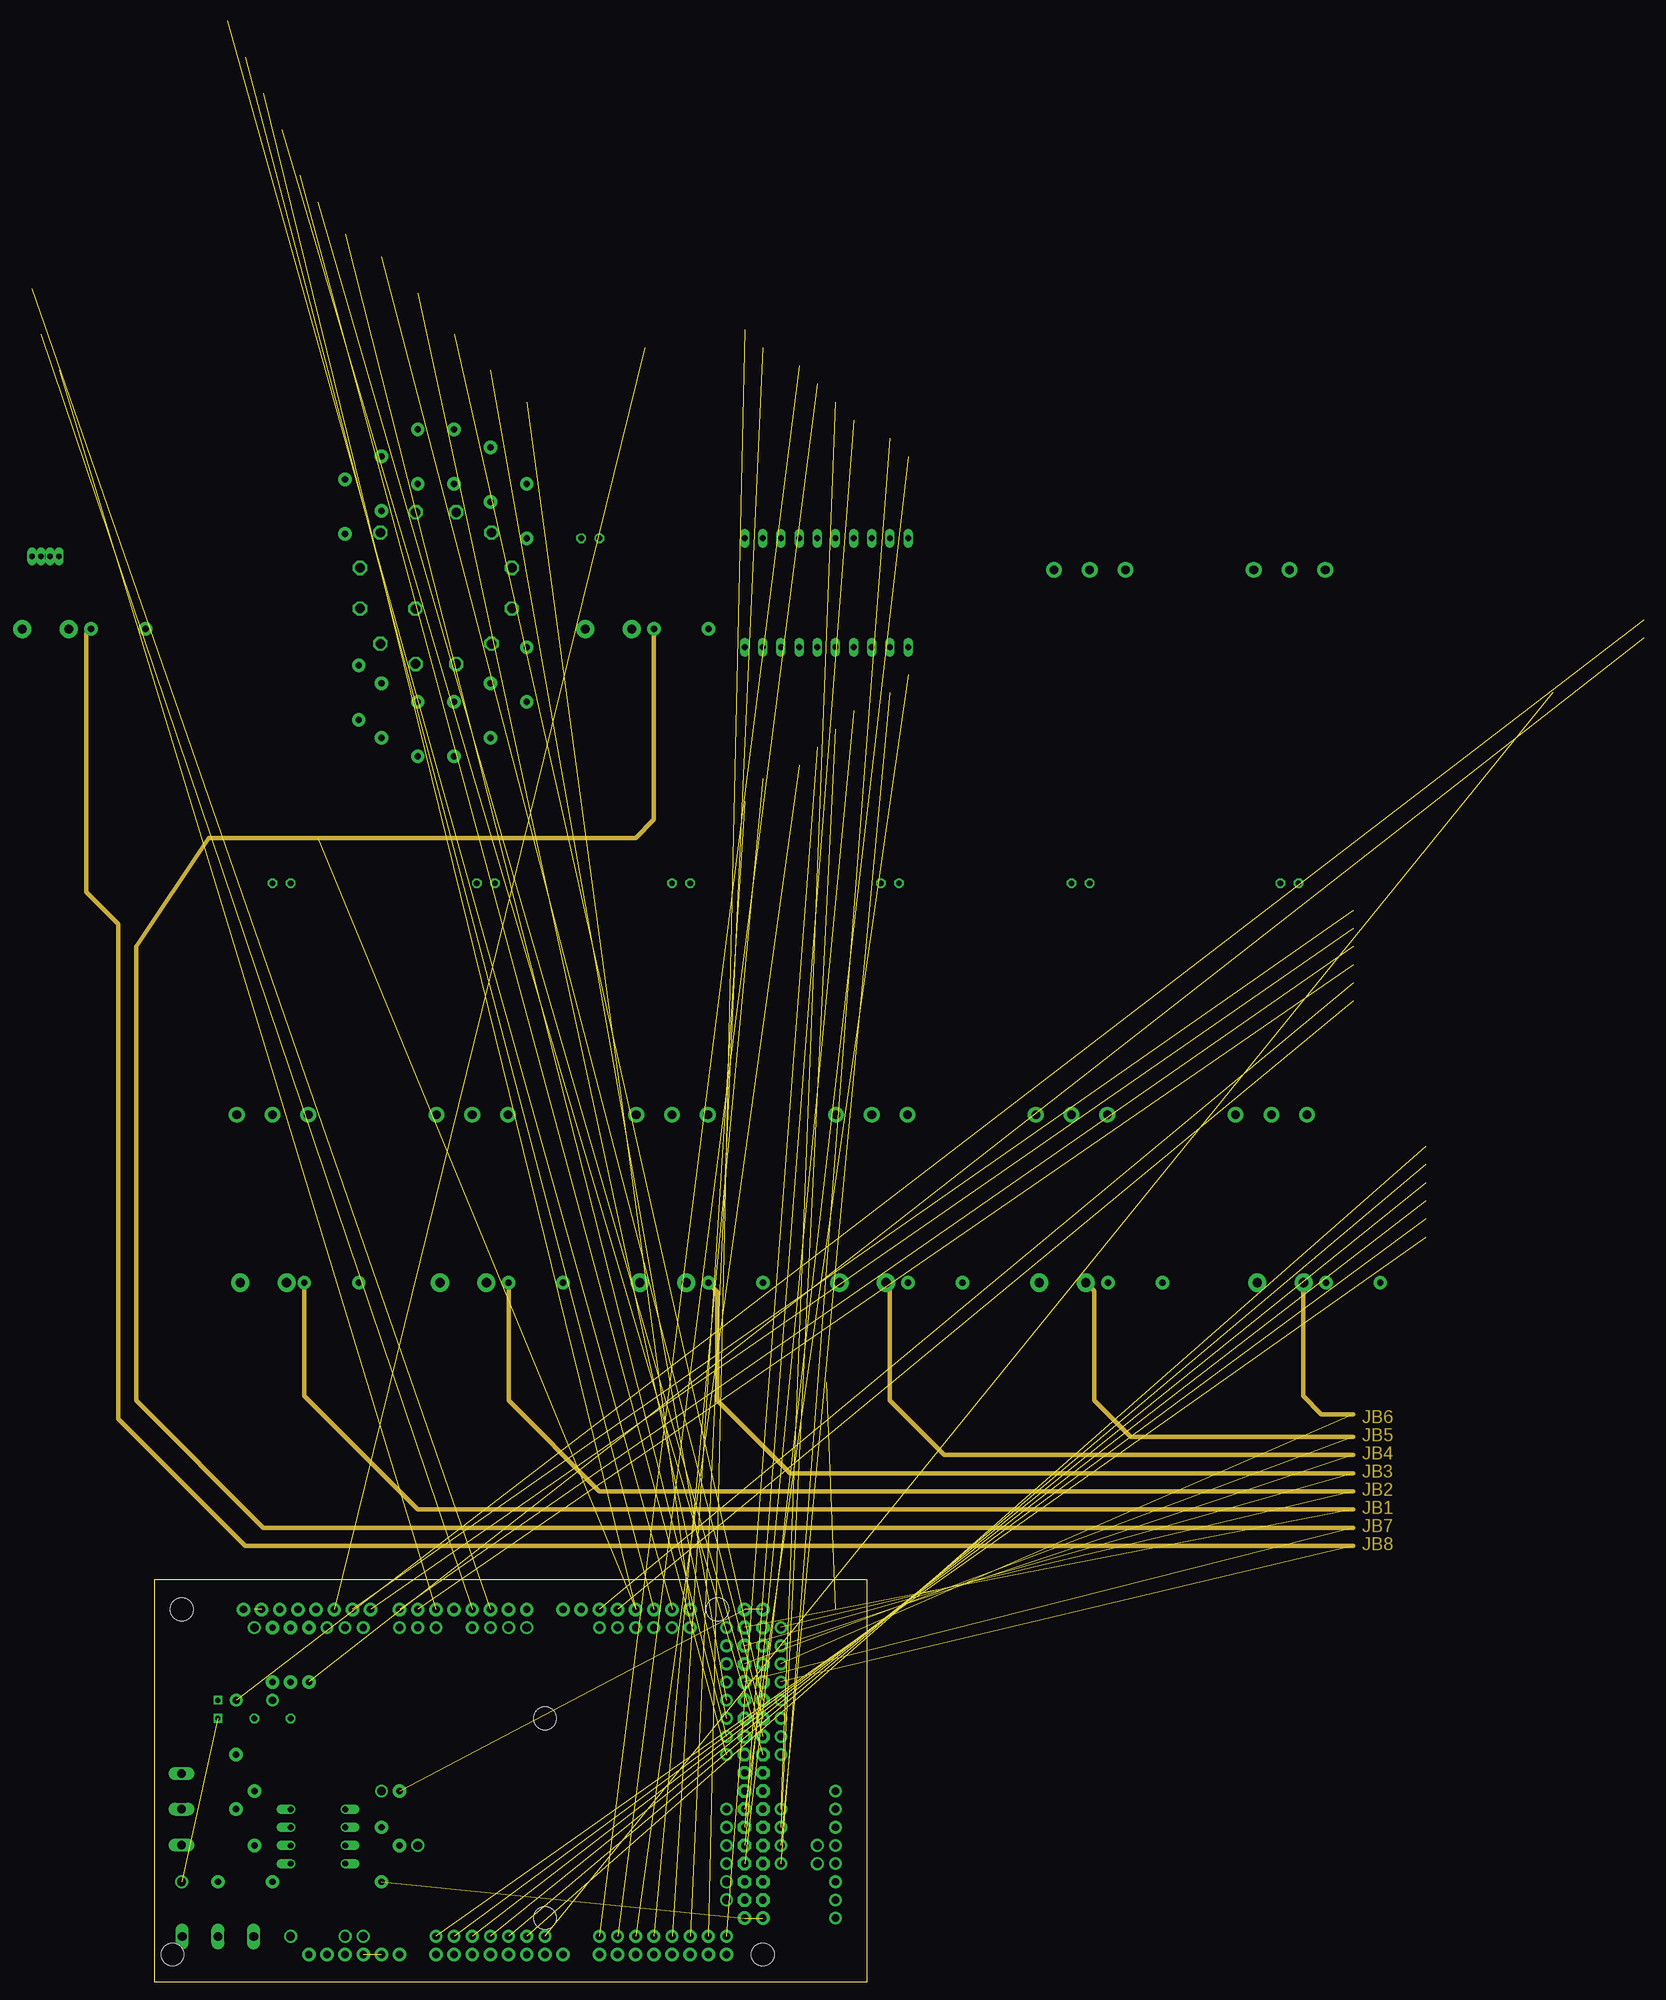
[diagram p6: board, inner layer Buttons]
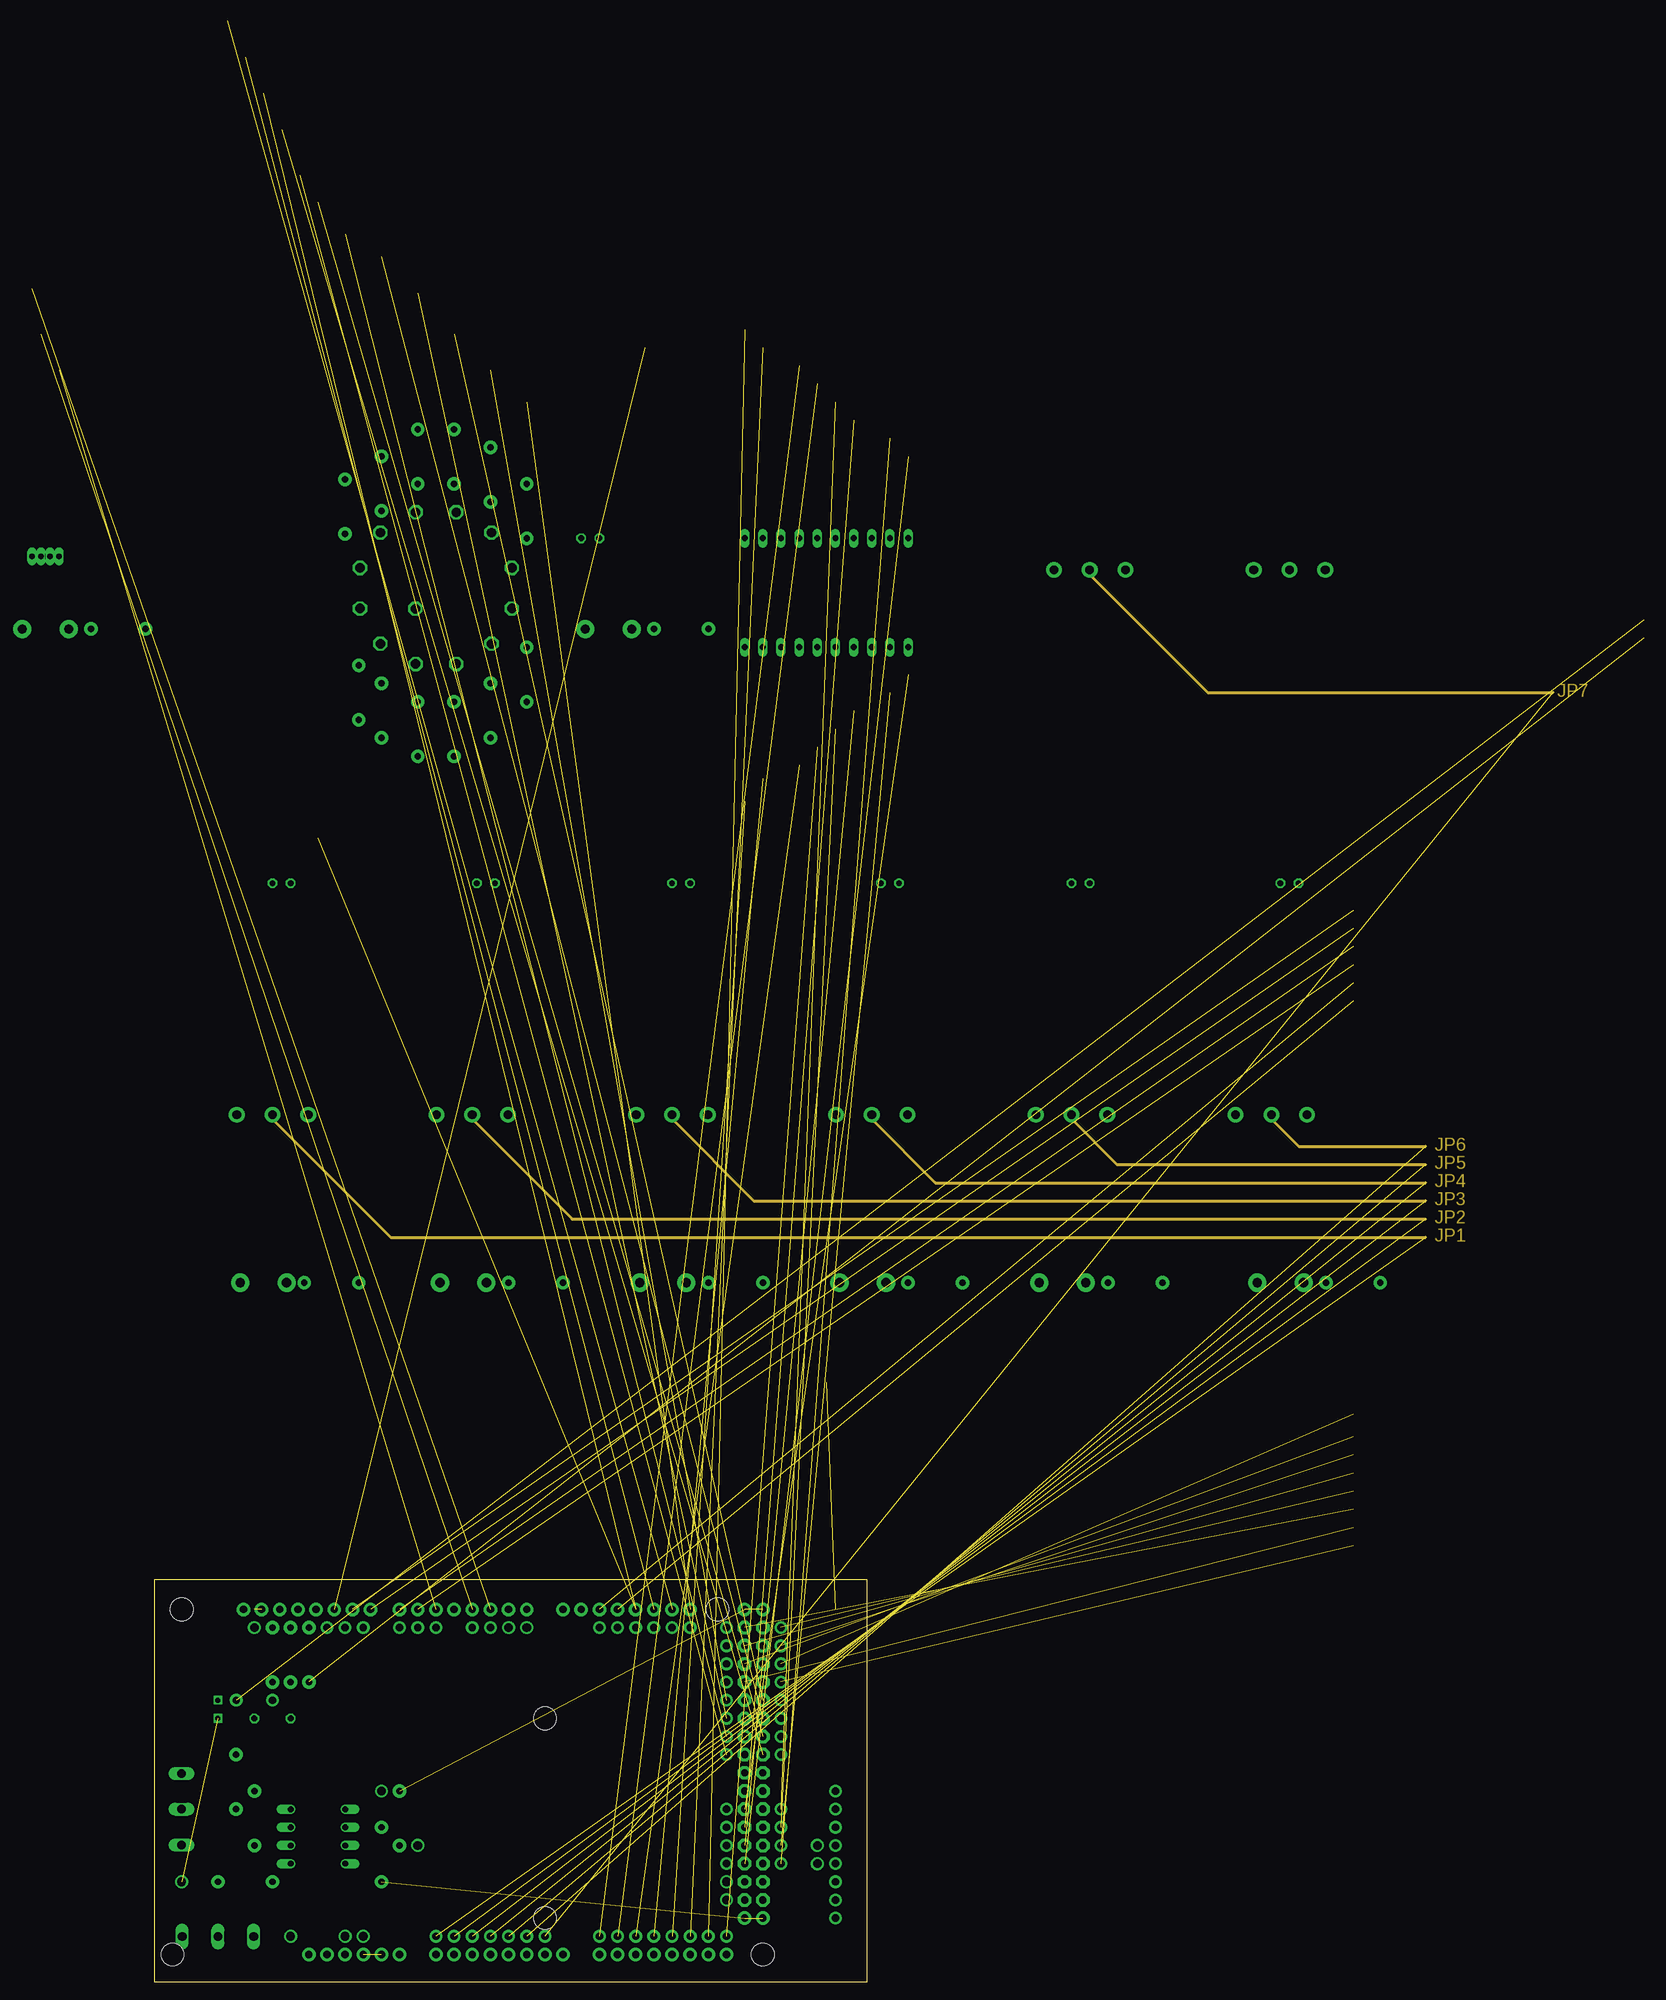
[diagram p7: board, inner layer Potentiometers]
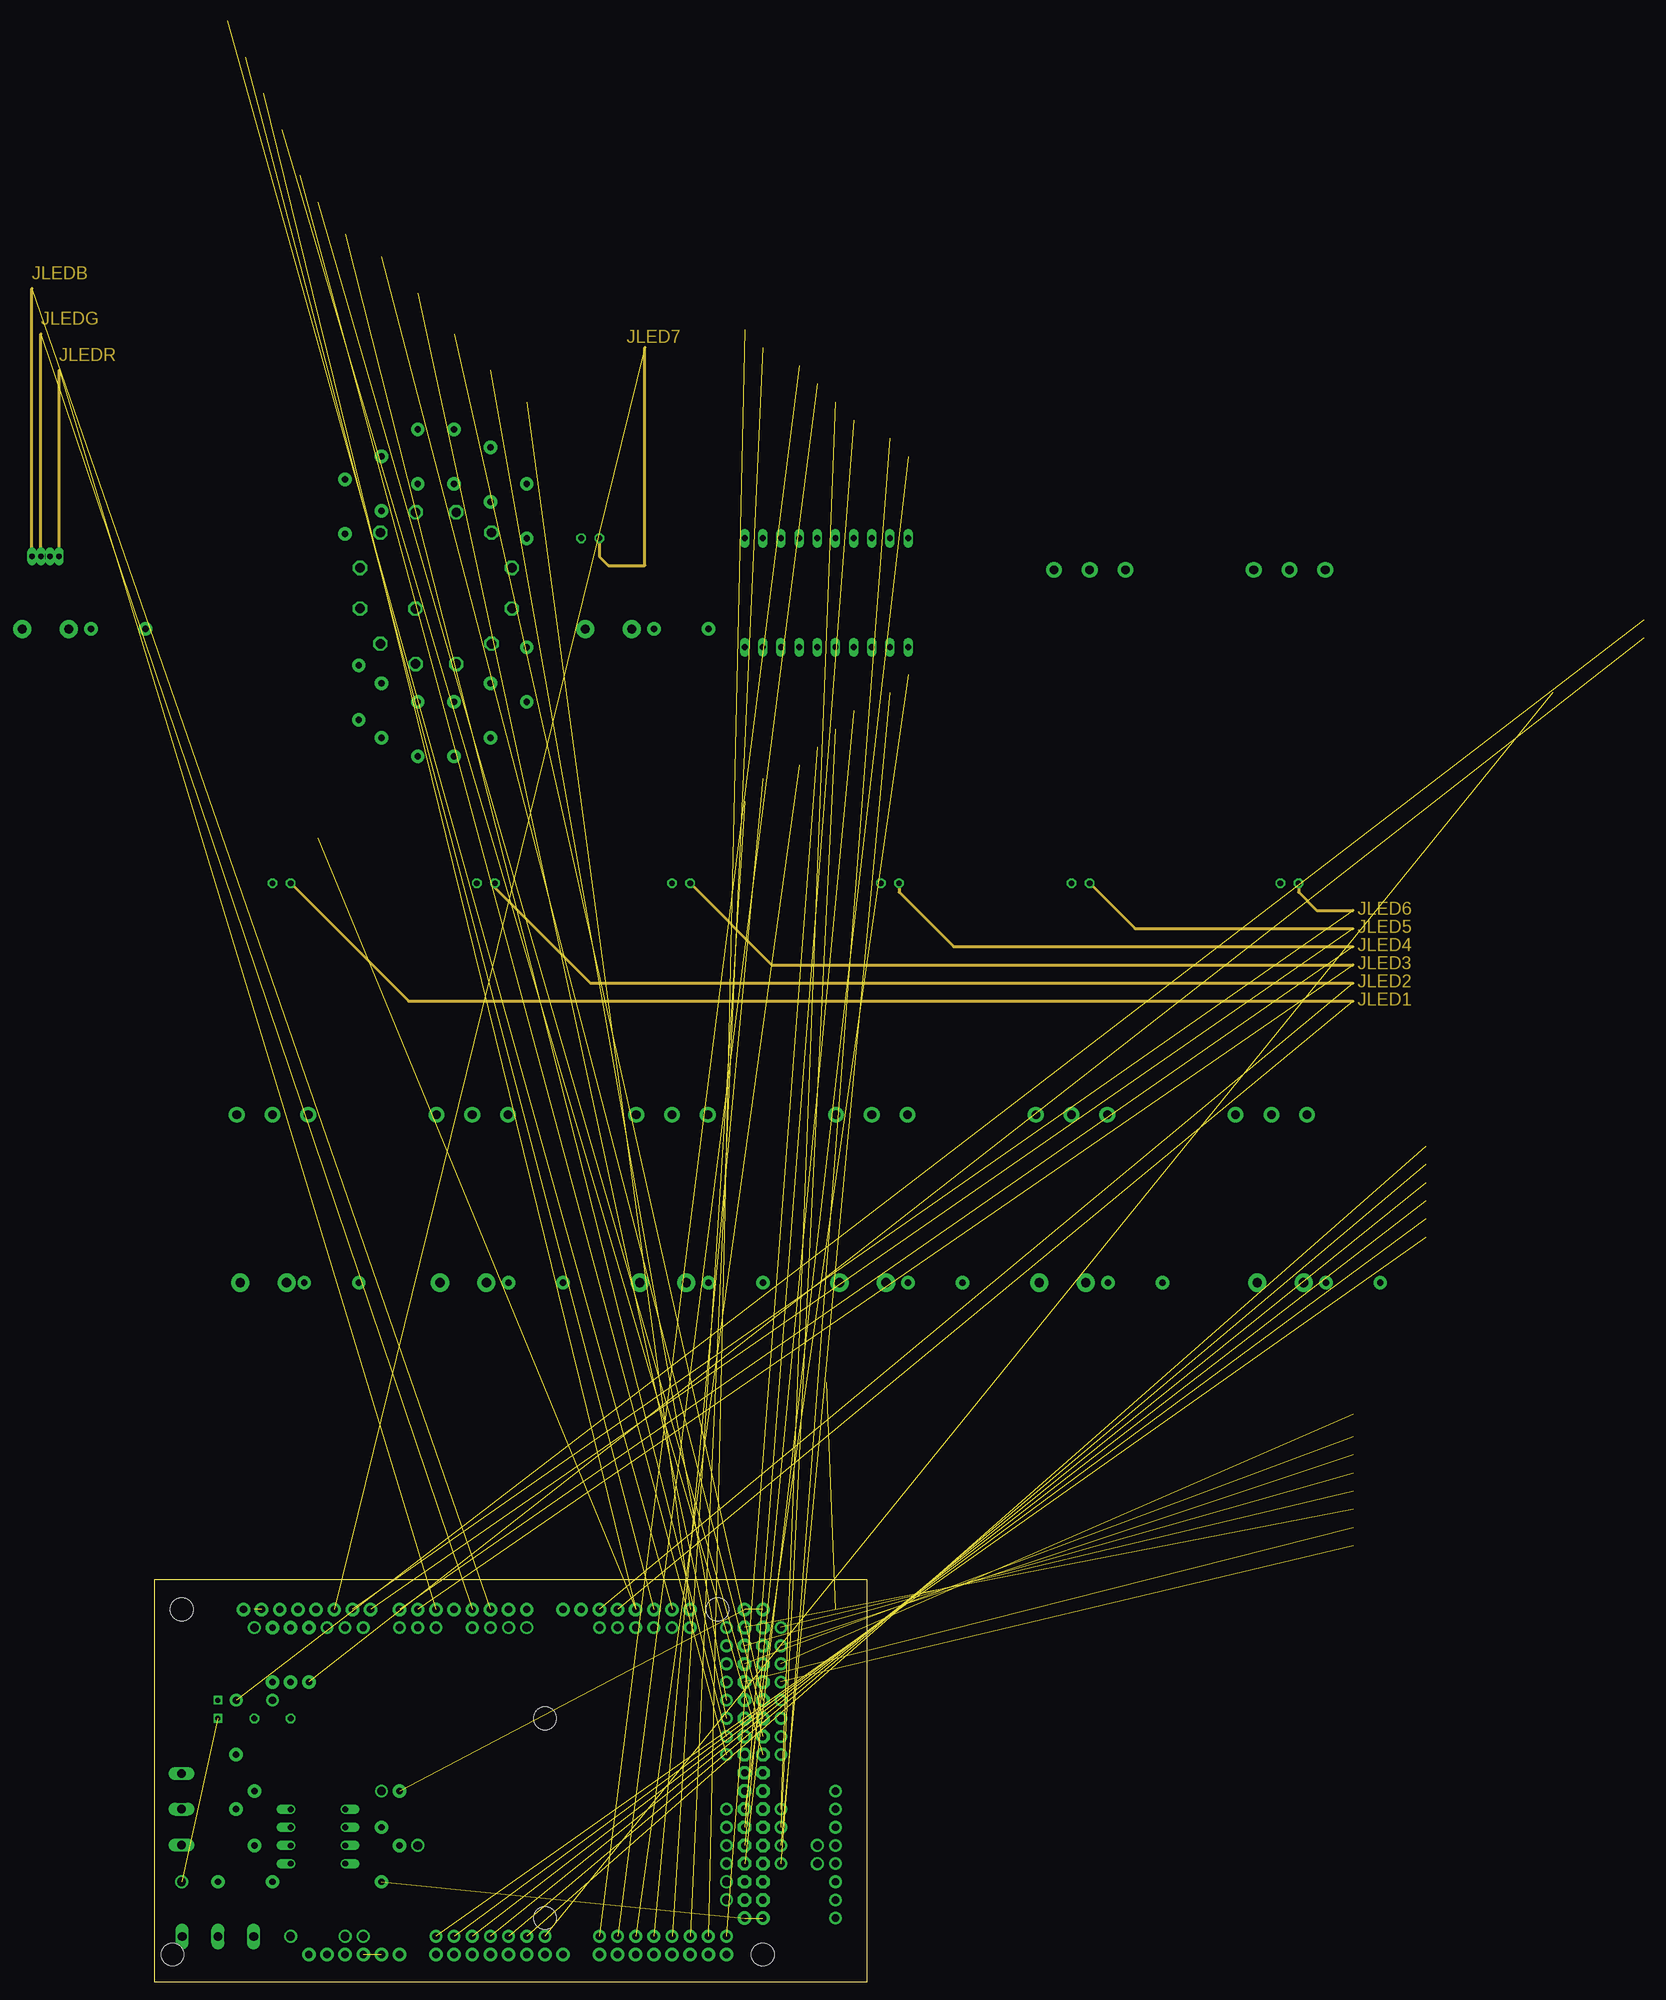
[diagram p8: board, inner layer LEDS]
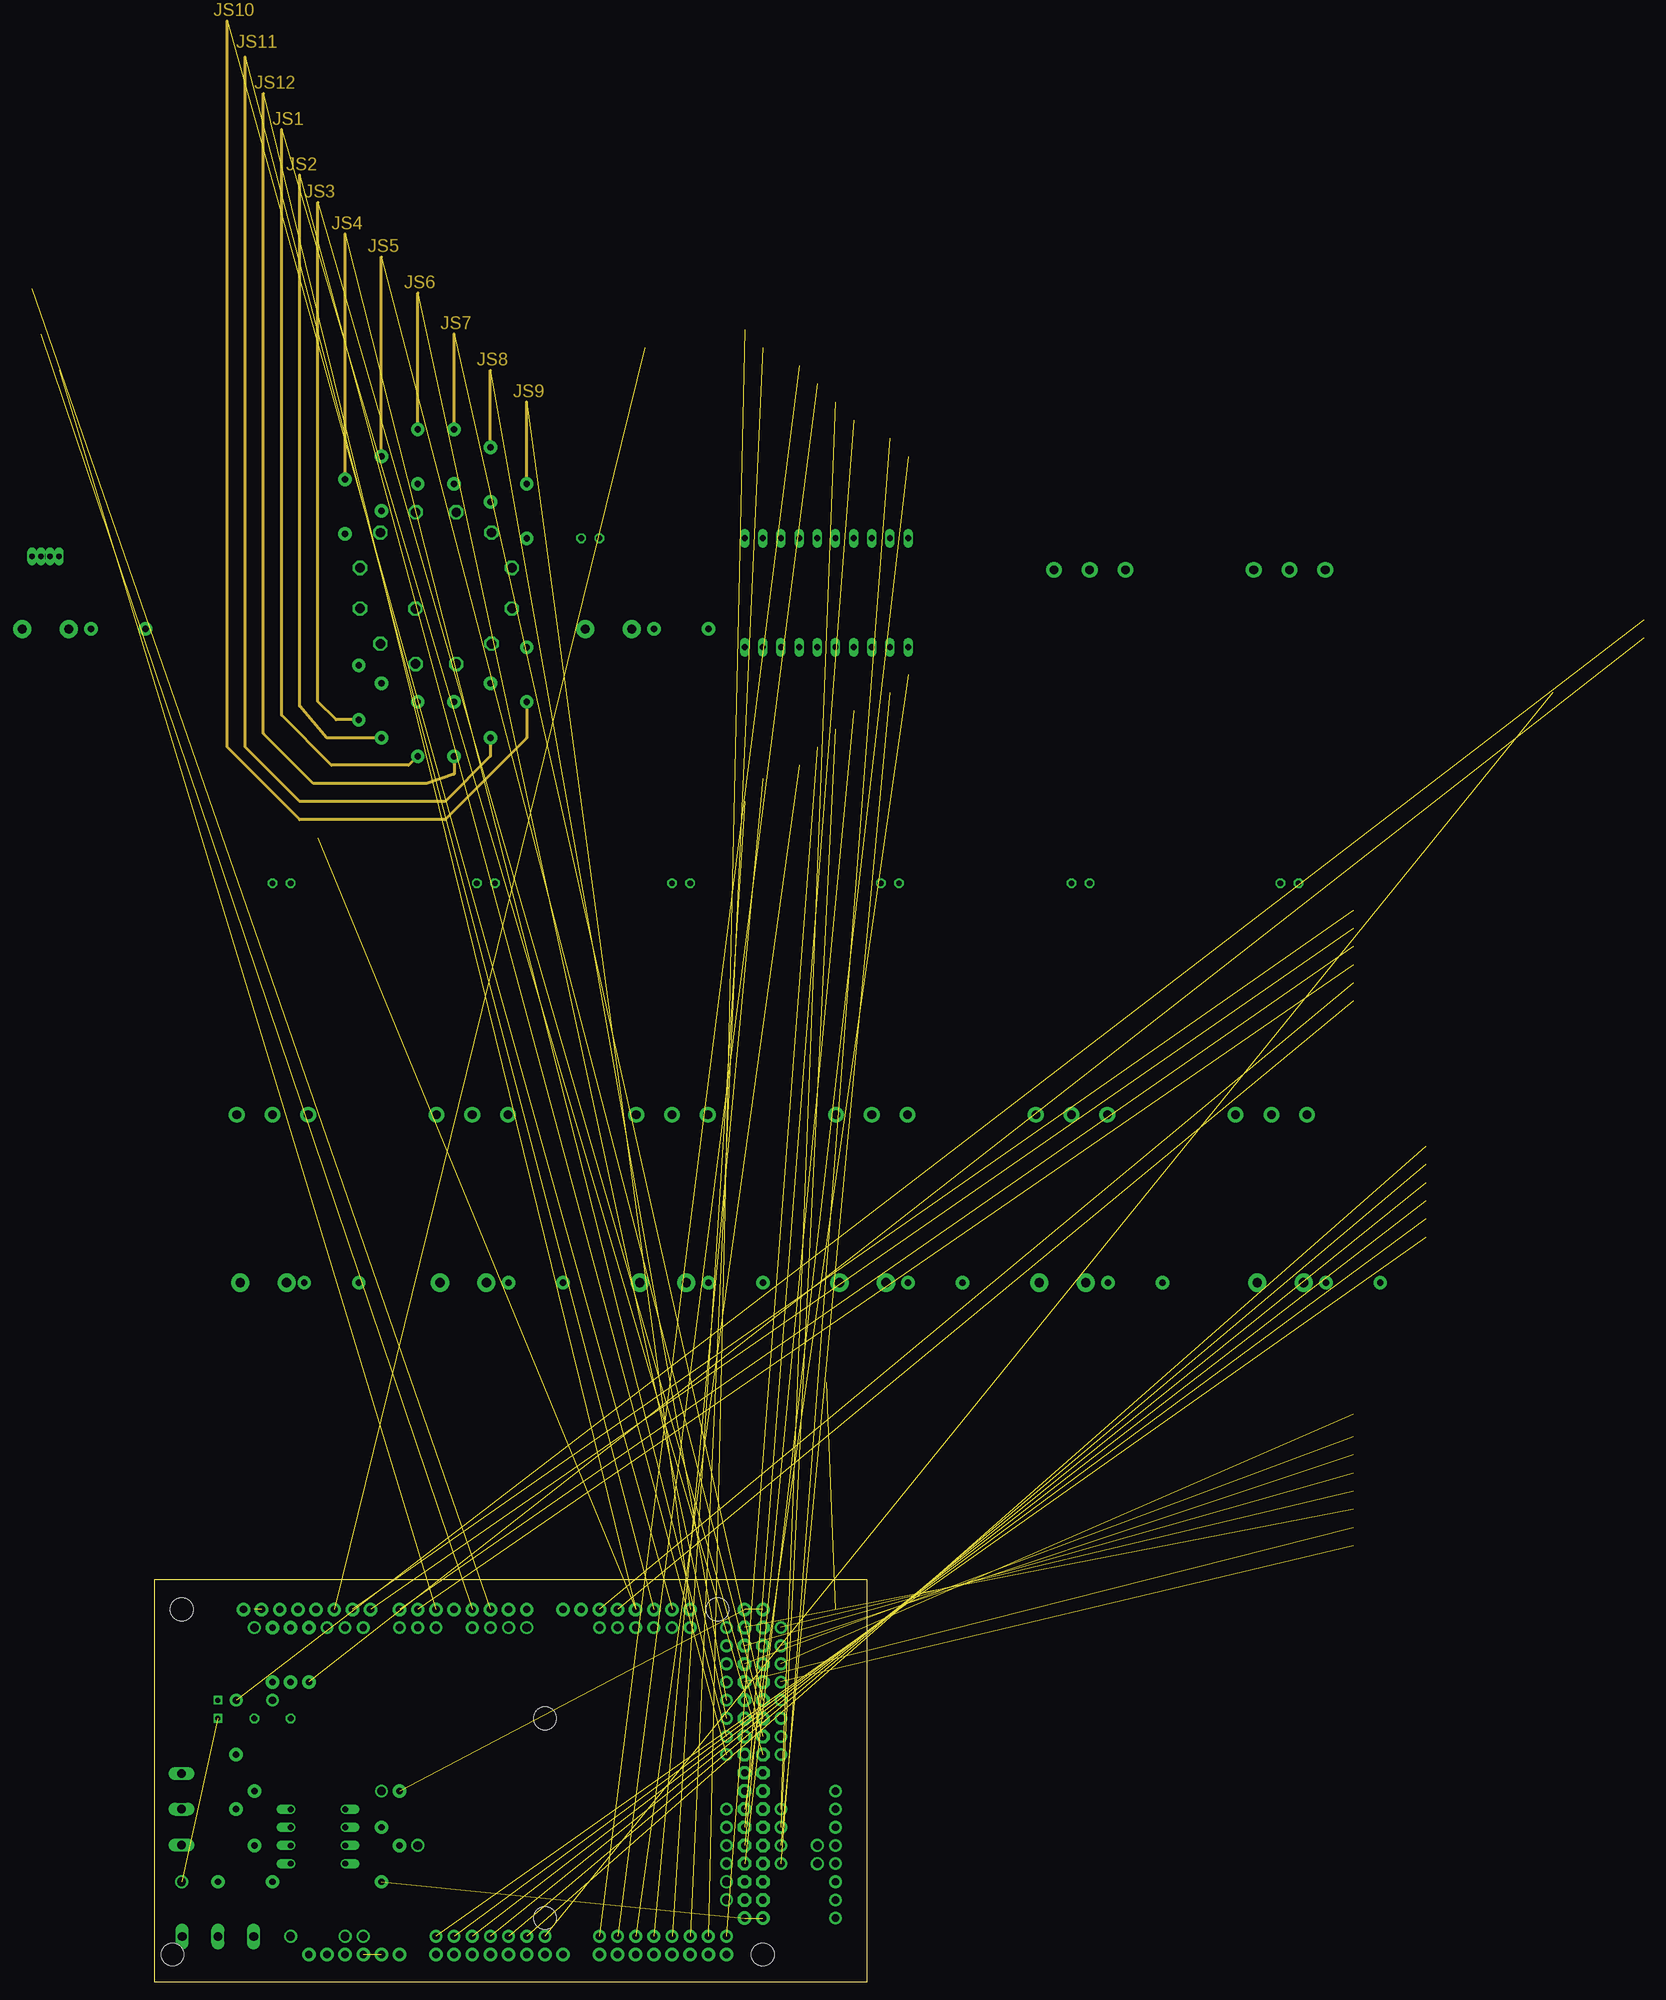
[diagram p9: board, inner layer RotSwitch]
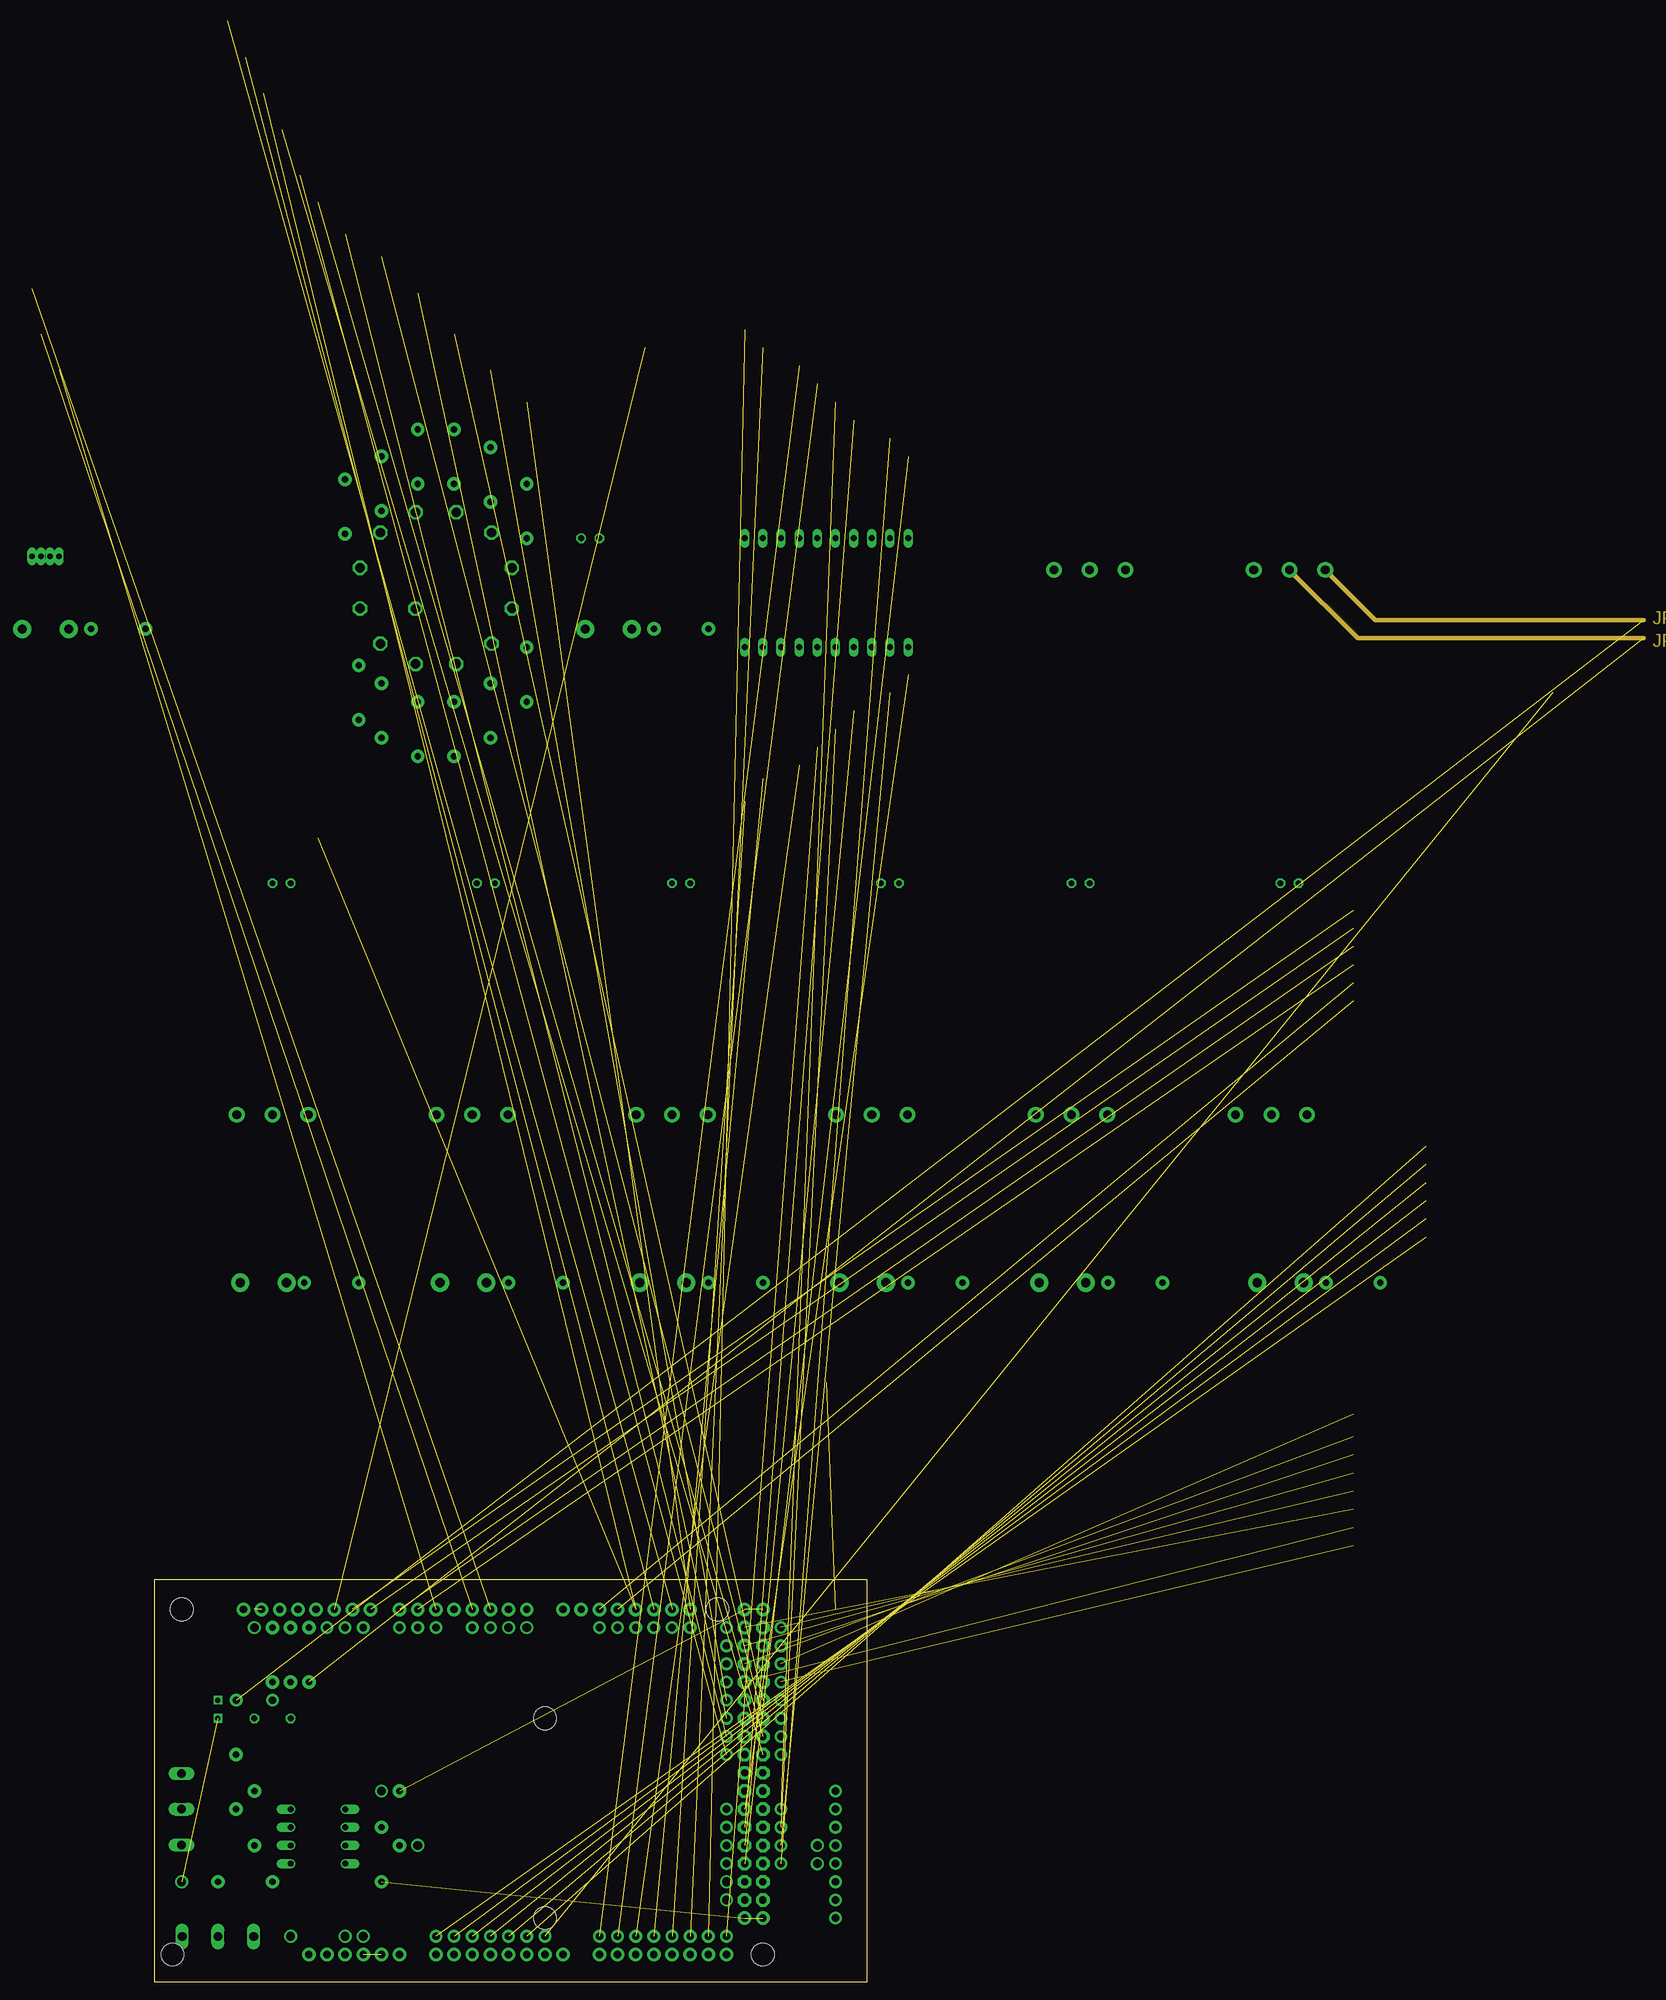
[diagram p10: board, inner layer Volume]
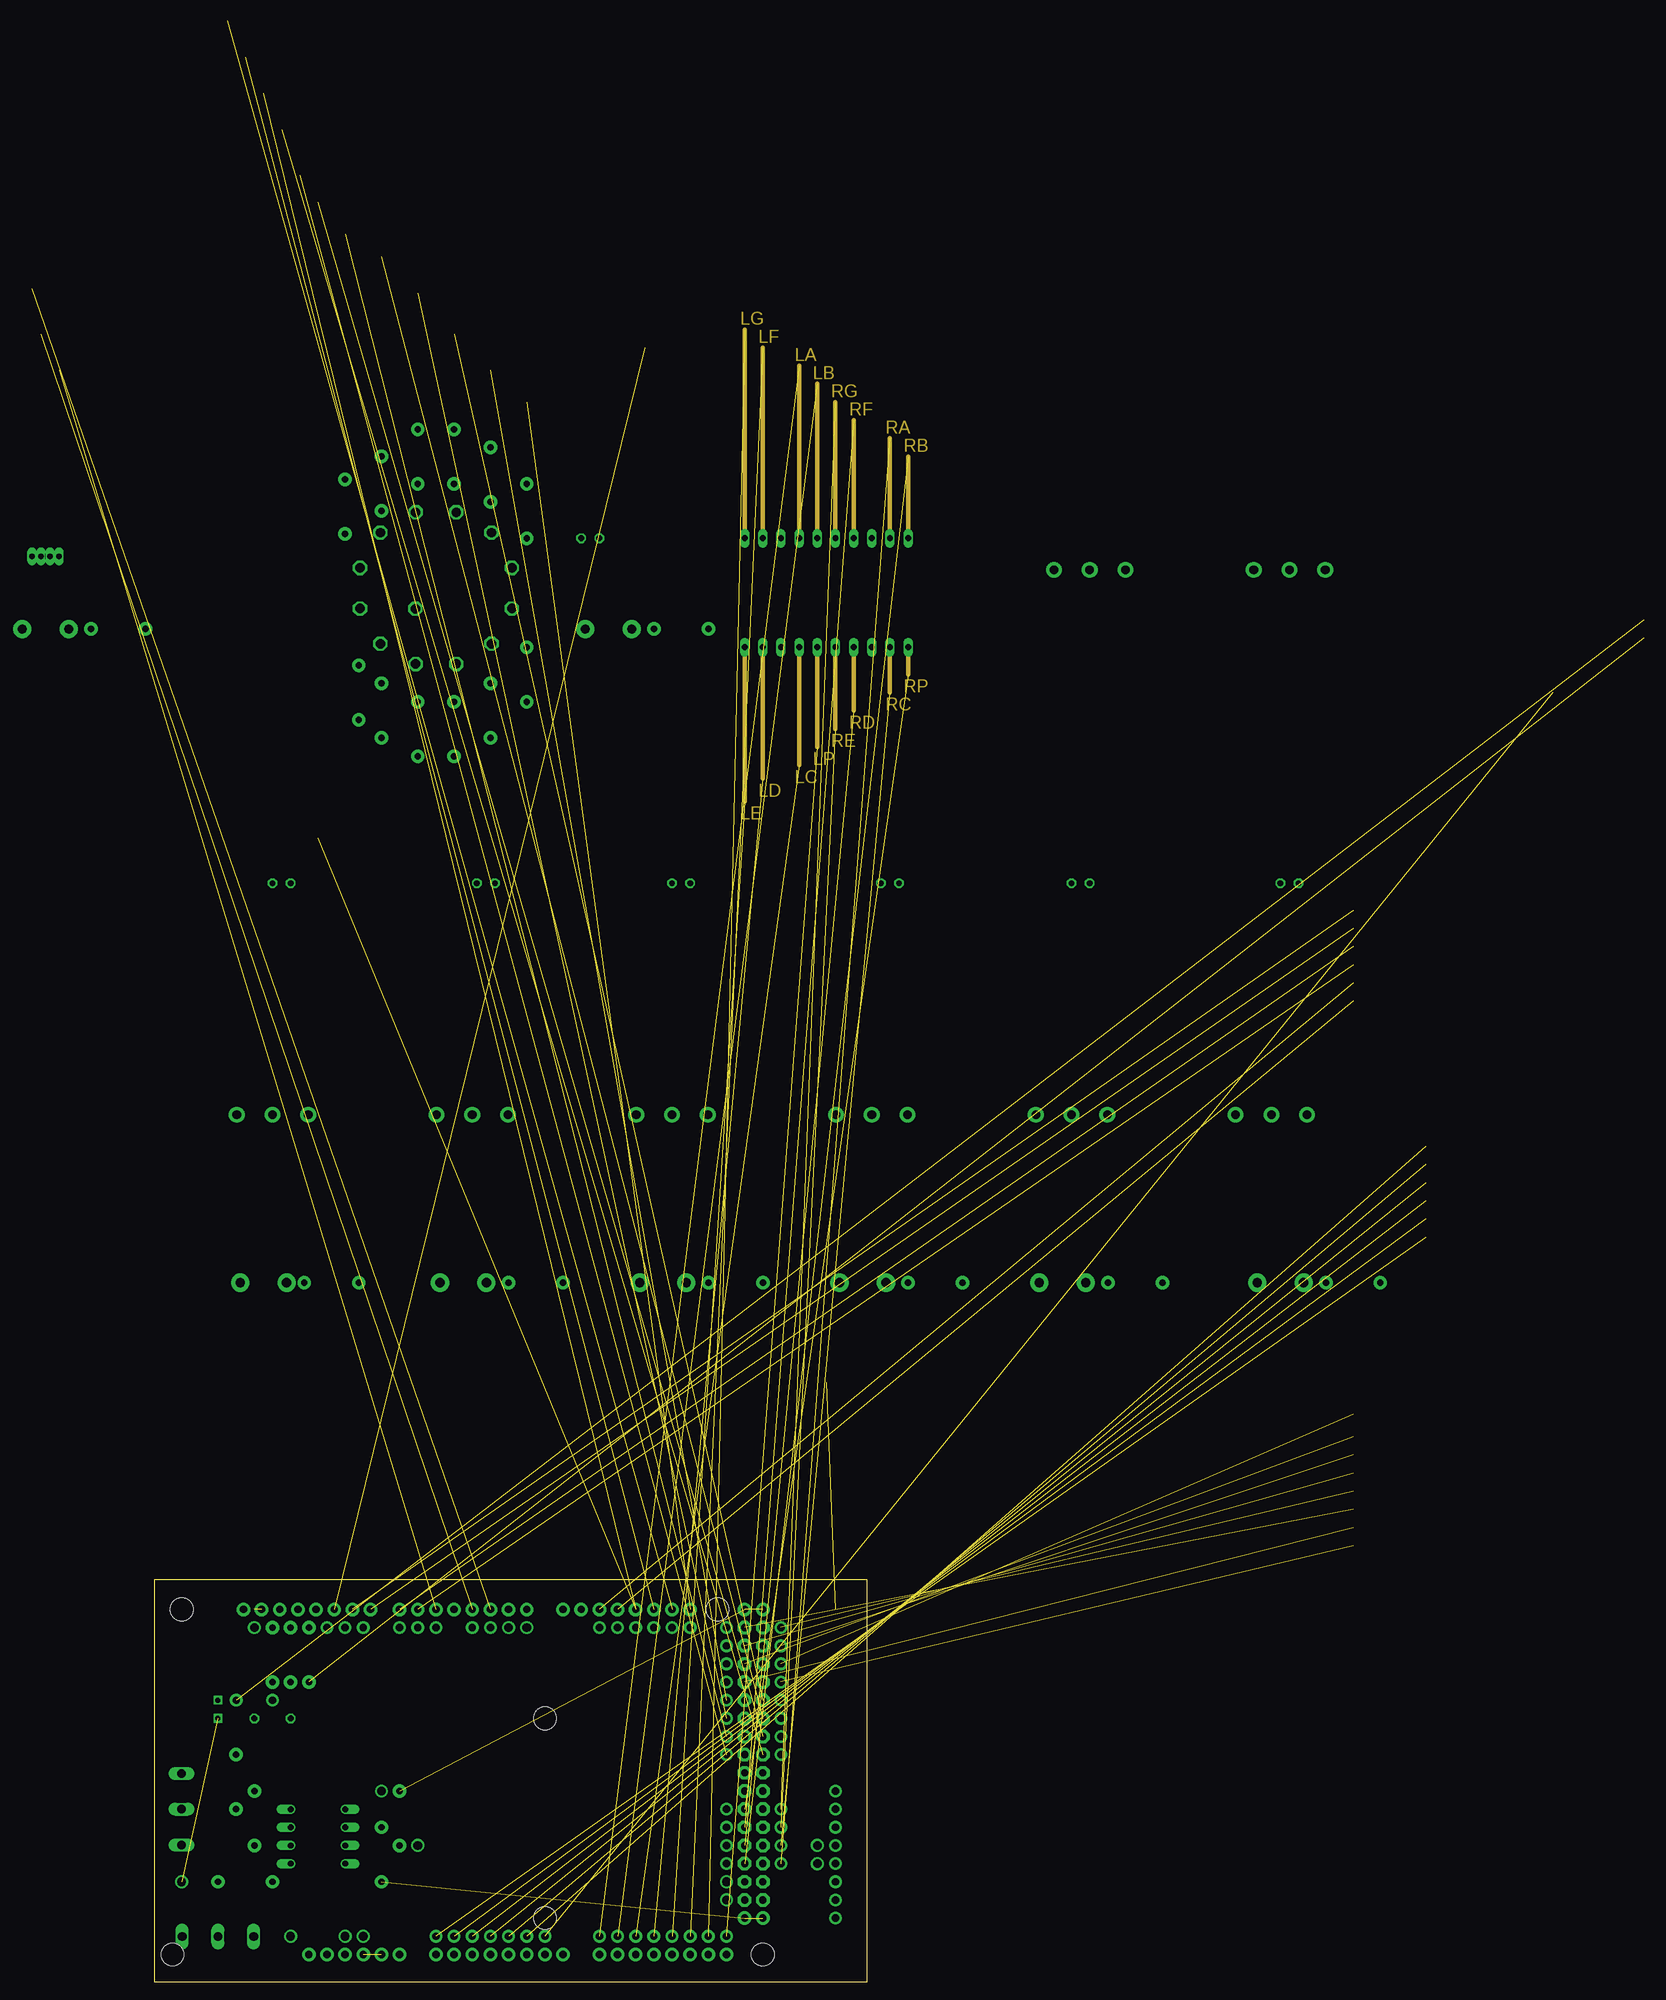
[diagram p11: board, inner layer Display]
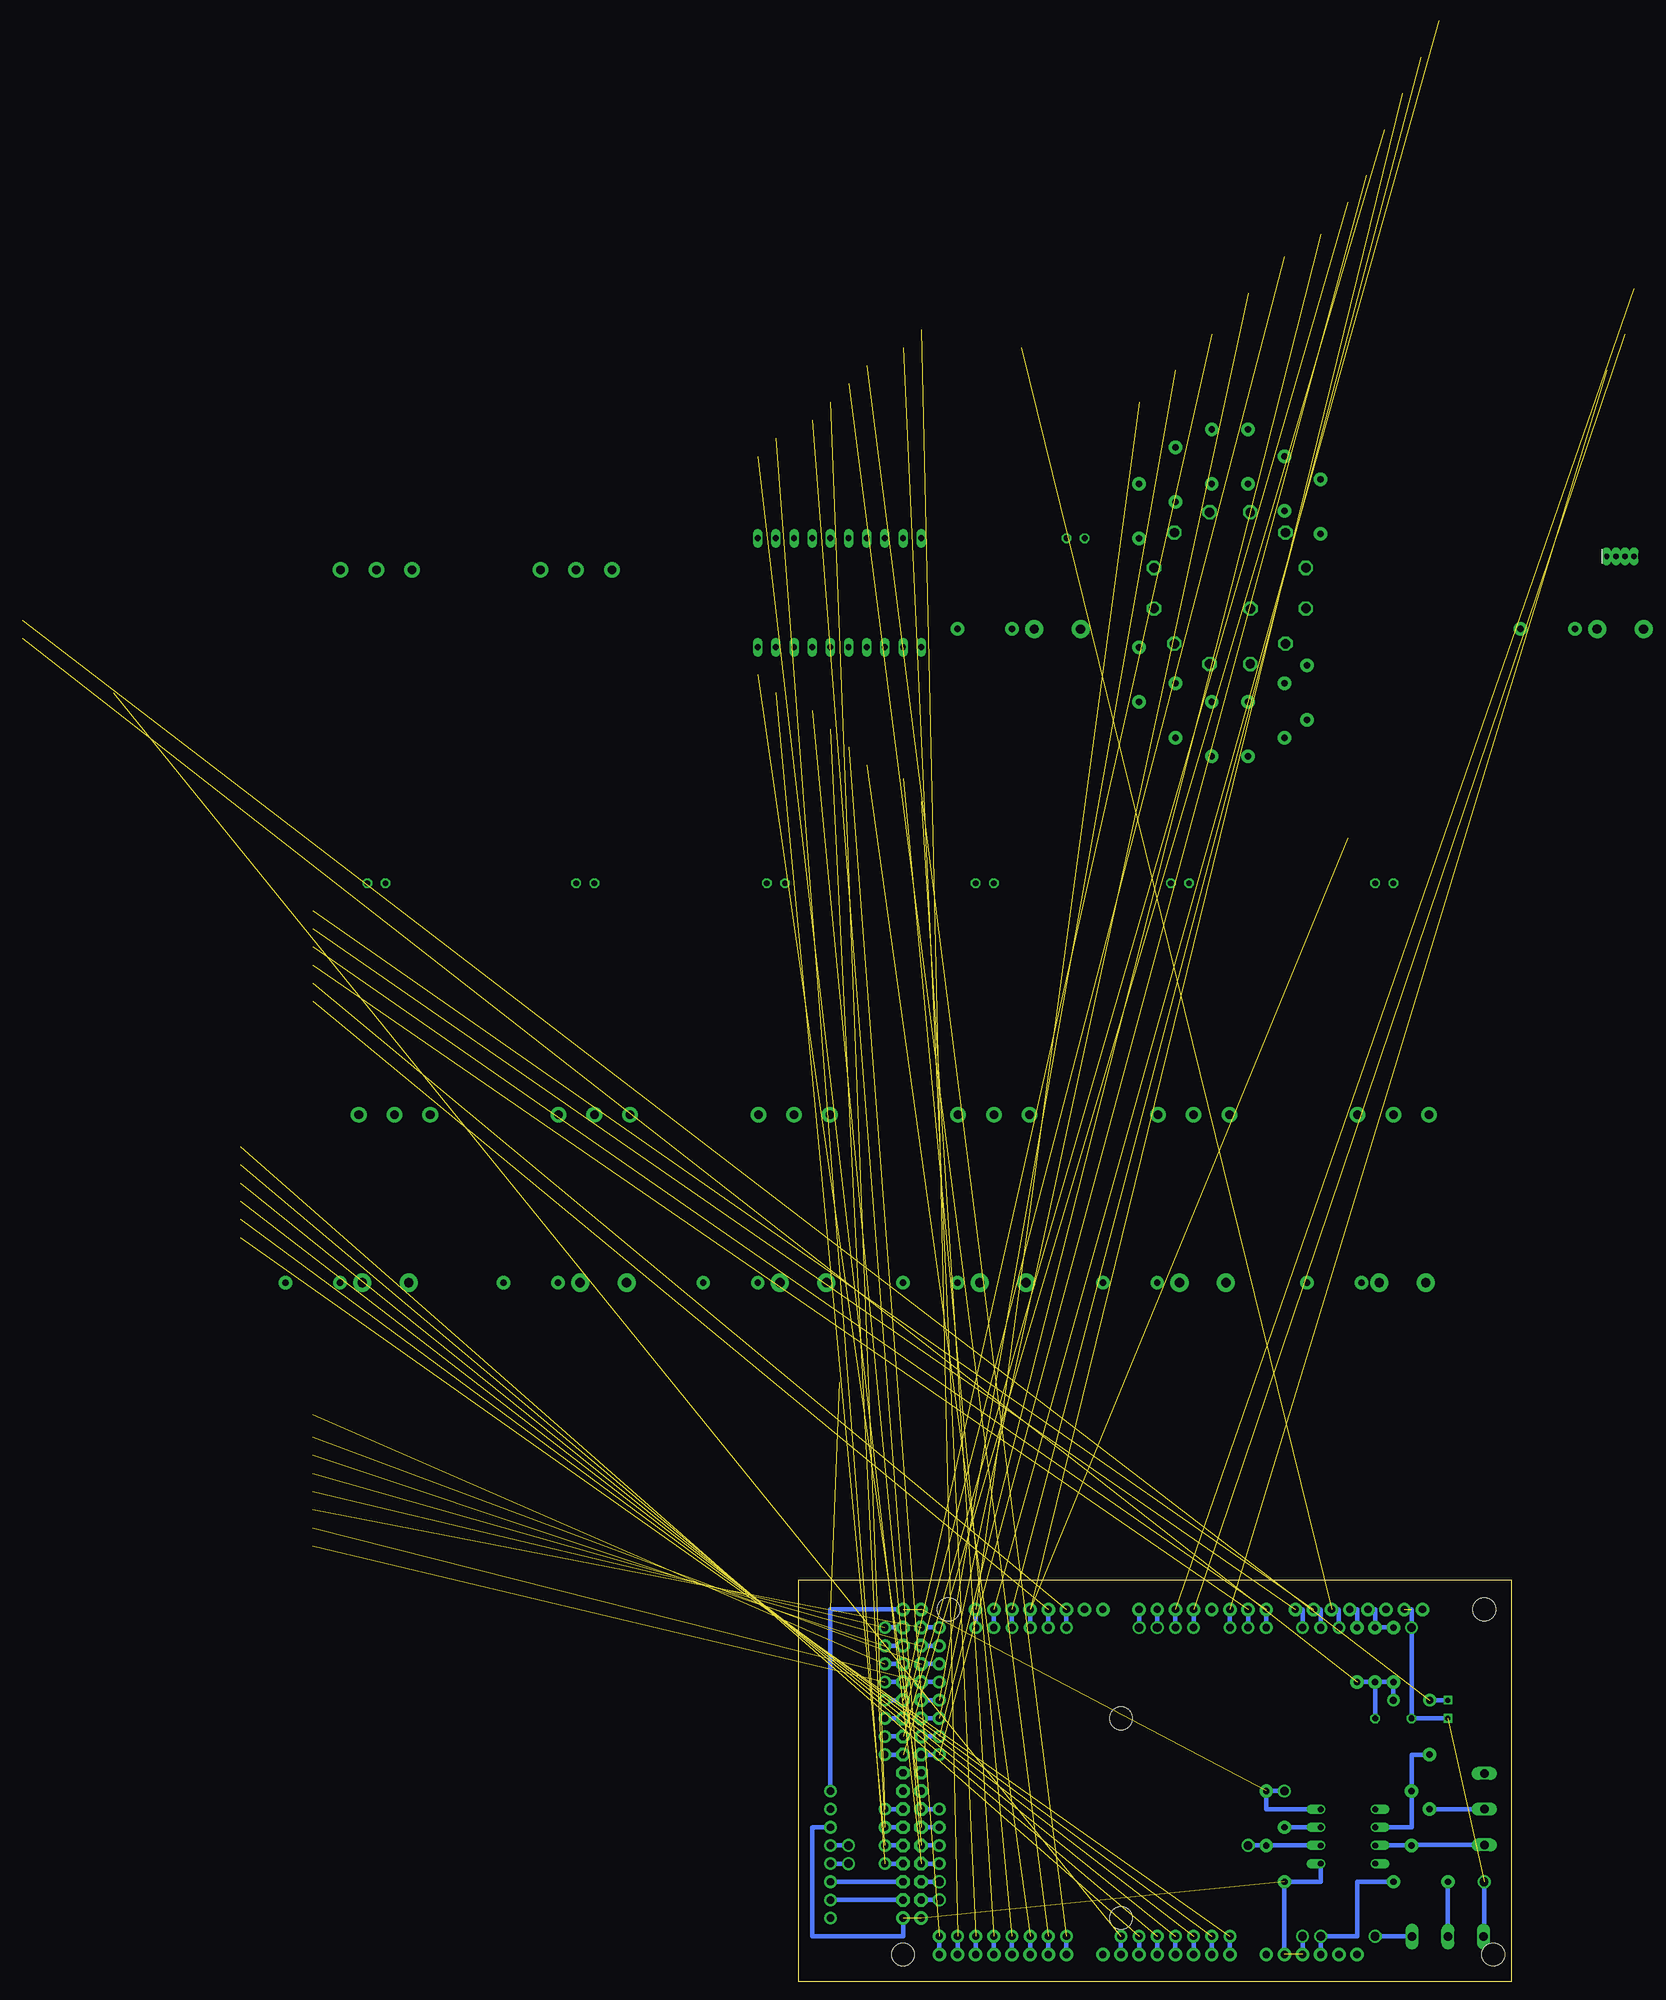
[diagram p12: board, bottom side, seen from below]

Size 99.67 x 56.19 mm. Coordinates in mm from the lower left corner, seen from the top.
Outline: 0,0 99.67,0 99.67,56.19 0,56.19 0,0
Copper layers (1+2+3+4+5+6+7+8+9+10+11+12+13+14+15+16): Top 0.035mm / dielectric 1.5mm / Ground 0.035mm / dielectric 0.15mm / 5V 0.035mm / dielectric 0.2mm / SolderOnComponent 0.035mm / dielectric 0.15mm / BoardWire 0.035mm / dielectric 0.2mm / Buttons 0.035mm / dielectric 0.15mm / Potentiometers 0.035mm / dielectric 0.2mm / LEDS 0.035mm / dielectric 0.15mm / RotSwitch 0.035mm / dielectric 0.2mm / Volume 0.035mm / dielectric 0.15mm / Display 0.035mm / dielectric 0.2mm / Route12 0.035mm / dielectric 0.15mm / Route13 0.035mm / dielectric 0.2mm / Route14 0.035mm / dielectric 0.15mm / Route15 0.035mm / dielectric 0.2mm / Bottom 0.035mm
Design rules "default *": minimum track width 10mil, minimum drill 24mil, track to track 8mil, track to pad 8mil, pad to pad 8mil, via to via 8mil, smd to smd 8mil, copper to edge 40mil, drill to drill 8mil, minimum pad ring 10mil, minimum via ring 8mil, stop-mask expansion 4mil, vias tented up to drill 0mil, thermal gap 10mil

### Footprints (pad centres in the part's own frame; a part is rotated, then mirrored left to right if it is on the bottom)
1X01-CLEANBIG = drill 1.016 pad 1.778: 1 0,0
ARDUINO_MEGA = drill 1.016 pad 1.88: 0 13.97,24.13; 1 11.43,24.13; 2 8.89,24.13; 3 6.35,24.13; 3.3V -13.97,-24.13; 4 3.81,24.13; 5 1.27,24.13; 5V@0 -11.43,-24.13; 5V@1 44.45,24.13; 5V@2 46.99,24.13; 6 -1.27,24.13; 7 -3.81,24.13; 8 -7.874,24.13; 9 -10.414,24.13; 10 -12.954,24.13; 11 -15.494,24.13; 12 -18.034,24.13; 13 -20.574,24.13; 14 19.05,24.13; 15 21.59,24.13; 16 24.13,24.13; 17 26.67,24.13; 18 29.21,24.13; 19 31.75,24.13; 20 34.29,24.13; 21 36.83,24.13; A0 1.27,-24.13; A1 3.81,-24.13; A2 6.35,-24.13; A3 8.89,-24.13; A4 11.43,-24.13; A5 13.97,-24.13; A6 16.51,-24.13; A7 19.05,-24.13; A8 24.13,-24.13; A9 26.67,-24.13; A10 29.21,-24.13; A11 31.75,-24.13; A12 34.29,-24.13; A13 36.83,-24.13; A14 39.37,-24.13; A15 41.91,-24.13; AREF -25.654,24.13; GND@0 -8.89,-24.13; GND@1 -6.35,-24.13; GND@2 44.45,-19.05; GND@3 46.99,-19.05; GND@4 -23.114,24.13; RESET -16.51,-24.13; VIN -3.81,-24.13 | drill 1.016 pad 1.88 octagon: 22 44.45,21.59; 23 46.99,21.59; 24 44.45,19.05; 25 46.99,19.05; 26 44.45,16.51; 27 46.99,16.51; 28 44.45,13.97; 29 46.99,13.97; 30 44.45,11.43; 31 46.99,11.43; 32 44.45,8.89; 33 46.99,8.89; 34 44.45,6.35; 35 46.99,6.35; 36 44.45,3.81; 37 46.99,3.81; 38 44.45,1.27; 39 46.99,1.27; 40 44.45,-1.27; 41 46.99,-1.27; 42 44.45,-3.81; 43 46.99,-3.81; 44 44.45,-6.35; 45 46.99,-6.35; 46 44.45,-8.89; 47 46.99,-8.89; 48 44.45,-11.43; 49 46.99,-11.43; 50 44.45,-13.97; 51 46.99,-13.97; 52 44.45,-16.51; 53 46.99,-16.51 | hole 3.2: -34.29,24.13; -35.56,-24.13; 16.51,8.89; 16.51,-19.05; 40.64,24.13; 46.99,-24.13
C050-025X075 = drill 0.813 octagon: 1 -2.54,0; 2 2.54,0
DIODE-1N4148 = drill 0.9 pad 1.88: A -3.81,0; C 3.81,0
7SEG-13 = drill 0.813 long: 1 -5.08,-7.62; 2 -2.54,-7.62; 3 0,-7.62; 4 2.54,-7.62; 5 5.08,-7.62; 6 5.08,7.62; 7 2.54,7.62; 8 0,7.62; 9 -2.54,7.62; 10 -5.08,7.62
TWO_PADS = drill 0.7 square: SLEEVE -1.27,0; TIP 1.27,0
LED3MM = drill 0.813 octagon: A -1.27,0; K 1.27,0
W237-103 = drill 1.194 long: 1 -5,-1.29; 2 0,-1.29; 3 5,-1.29
DIL08 = drill 0.813 offset: 1 -3.81,-3.81; 2 -1.27,-3.81; 3 1.27,-3.81; 4 3.81,-3.81; 5 3.81,3.81; 6 1.27,3.81; 7 -1.27,3.81; 8 -3.81,3.81
3RP/1610N = drill 1.2 pad 2.184: 1 -5,0; 2 0,0; 3 5,0
AXIAL-0.3 = drill 0.9 pad 1.88: P$1 -3.81,0; P$2 3.81,0
LED-RGB-THRU = drill 0.762 pad 0.889 long: 1 1.905,0; 2 0.635,0; 3 -0.635,0; 4 -1.905,0
CK101X12 = drill 1.321 octagon: 1 -2.845,-10.617; 2 -7.772,-7.772; 3 -10.617,-2.845; 4 -10.617,2.845; 5 -7.772,7.772; 6 -2.845,10.617; 7 2.845,10.617; 8 7.772,7.772; 9 10.617,2.845; 10 10.617,-2.845; 11 7.772,-7.772; 12 2.845,-10.617; A -2.87,-2.87
TACT_PANA-EVQ = drill 1.3 pad 2.54: P$1 -3.25,0; P$2 3.25,0

### Placement (x,y rotation side)
3V3  95.25,24.13 90 top
5V  95.25,26.67 270 top
B1  38.1,27.94 0 top
C1  16.51,36.83 180 top
CD  95.25,8.89 90 top
CLK  95.25,19.05 90 top
CS  95.25,11.43 270 top
D1  13.97,22.86 90 top
DI  95.25,13.97 90 top
DLEFT  87.63,194.31 0 top  (outside the outline)
DO  95.25,16.51 270 top
DRIGHT  100.33,194.31 0 top  (outside the outline)
GND  95.25,21.59 270 top
JA  8.89,38.1 90 top
JB1  80.01,49.53 90 top
JB2  87.63,49.53 270 top
JB3  80.01,46.99 90 top
JB4  87.63,46.99 270 top
JB5  80.01,44.45 90 top
JB6  87.63,44.45 270 top
JB7  80.01,41.91 90 top
JB8  87.63,41.91 270 top
JLED1  64.77,49.53 180 top
JLED2  62.23,49.53 180 top
JLED3  36.83,49.53 180 top
JLED4  34.29,49.53 180 top
JLED5  29.21,49.53 180 top
JLED6  26.67,49.53 180 top
JLED7  24.13,49.53 180 top
JLEDB  46.99,49.53 180 top
JLEDG  44.45,49.53 180 top
JLEDR  39.37,49.53 180 top
JP1  39.37,6.35 0 top
JP2  41.91,6.35 0 top
JP3  44.45,6.35 0 top
JP4  46.99,6.35 0 top
JP5  49.53,6.35 0 top
JP6  52.07,6.35 0 top
JP7  54.61,6.35 0 top
JP8-2  16.51,39.37 0 top
JP8-3  11.43,39.37 0 top
JS1  87.63,31.75 270 top
JS2  80.01,31.75 90 top
JS3  87.63,34.29 270 top
JS4  80.01,34.29 90 top
JS5  87.63,36.83 270 top
JS6  80.01,36.83 90 top
JS7  87.63,39.37 270 top
JS8  80.01,39.37 90 top
JS9  74.93,49.53 180 top
JS10  72.39,49.53 180 top
JS11  69.85,49.53 180 top
JS12  67.31,49.53 180 top
LA  62.23,6.35 0 top
LB  64.77,6.35 0 top
LC  67.31,6.35 0 top
LD  69.85,6.35 0 top
LE  72.39,6.35 0 top
LED1  17.78,153.67 180 top  (outside the outline)
LED2  46.35,153.67 180 top  (outside the outline)
LED3  73.66,153.67 180 top  (outside the outline)
LED4  102.87,153.67 180 top  (outside the outline)
LED5  129.54,153.67 180 top  (outside the outline)
LED6  158.75,153.67 180 top  (outside the outline)
LED7  60.96,201.93 180 top  (outside the outline)
LF  74.93,6.35 0 top
LG  77.47,6.35 0 top
LP  80.01,6.35 0 top
MIDI_IN  5.08,24.13 270 top
MIDI_OUT  8.89,7.62 0 top
OK1  22.86,20.32 270 top
P1  16.51,121.28 0 top  (outside the outline)
P2  44.45,121.28 0 top  (outside the outline)
P3  72.39,121.28 0 top  (outside the outline)
P4  100.33,121.28 0 top  (outside the outline)
P5  128.27,121.28 0 top  (outside the outline)
P6  156.21,121.28 0 top  (outside the outline)
P7  130.81,197.49 0 top  (outside the outline)
P8  158.75,197.49 0 top  (outside the outline)
R1  24.77,97.79 0 top  (outside the outline)
R2  53.34,97.79 0 top  (outside the outline)
R3  81.28,97.79 0 top  (outside the outline)
R4  109.22,97.79 0 top  (outside the outline)
R5  137.16,97.79 0 top  (outside the outline)
R6  167.64,97.79 0 top  (outside the outline)
R7  73.66,189.23 0 top  (outside the outline)
R8  -5.08,189.23 0 top  (outside the outline)
R9  36.83,175.26 270 top  (outside the outline)
R10  31.75,177.8 270 top  (outside the outline)
R11  28.57,180.34 270 top  (outside the outline)
R12  26.67,206.38 90 top  (outside the outline)
R13  31.75,209.55 90 top  (outside the outline)
R14  36.83,213.36 90 top  (outside the outline)
R15  41.91,213.36 90 top  (outside the outline)
R16  46.99,210.82 90 top  (outside the outline)
R17  52.07,205.74 90 top  (outside the outline)
R18  52.07,182.88 270 top  (outside the outline)
R19  46.99,177.8 270 top  (outside the outline)
R20  41.91,175.26 270 top  (outside the outline)
R21  16.51,45.72 90 top
R22  19.05,45.72 90 top
R23  21.59,45.72 90 top
R24  11.43,27.94 270 top
R25  34.29,22.86 270 top
R26  31.75,17.78 270 top
R27  12.7,13.97 180 top
RA  87.63,16.51 270 top
RB  80.01,16.51 90 top
RC  87.63,19.05 270 top
RD  80.01,19.05 90 top
RE  87.63,21.59 270 top
RF  80.01,21.59 90 top
RG  87.63,24.13 270 top
RGB  -15.24,199.39 0 top  (outside the outline)
RP  80.01,24.13 90 top
S1  39.37,194.94 0 top  (outside the outline)
SW1  15.24,97.79 0 top  (outside the outline)
SW2  43.18,97.79 0 top  (outside the outline)
SW3  71.12,97.79 0 top  (outside the outline)
SW4  99.06,97.79 0 top  (outside the outline)
SW5  127,97.79 0 top  (outside the outline)
SW6  157.48,97.79 0 top  (outside the outline)
SW7  63.5,189.23 0 top  (outside the outline)
SW8  -15.24,189.23 0 top  (outside the outline)

### Tracks (layer width: path | path; a pad name or v marks a point on that pad's centre or on a via)
+5V  (via drill 1.2)  (3 unrouted)
  5V 0.61: P3.3 77.39,128.19 | 77.39,128.19 arc-90 84.45,135.25 100.33,135.25 arc-90 105.41,130.18 105.41,121.36 arc-90 P4.3 105.33,128.19 arc-90 111.76,134.62 127.64,134.62 arc-90 133.35,128.91 133.35,121.36 arc-90 P5.3 133.27,128.19 arc-90 139.7,134.62 154.94,134.62 arc-90 161.93,127.64 161.93,122 arc-90 P6.3 arc90 185.42,148.03 185.42,200.66 arc90 175.26,210.82 149.15,210.82 arc90 P7.3 135.81,202.01 arc90 127,210.82 88.9,210.82 arc90 77.47,199.39 77.47,190.5 | P2.3 49.45,121.92 | 49.45,121.92 49.45,128.82 arc-90 55.88,135.25 70.33,135.25 arc-90 77.39,128.19 | 49.45,121.92 arc90 49.53,122 49.53,129.54 arc90 43.81,135.25 29.84,135.25 arc90 21.51,126.92 P1.3 arc-90 30.48,118.03 30.48,99.69 arc-90 R1.P$2 arc90 40.64,83.82 45.72,83.82 arc90 R2.P$2 arc90 66.04,83.82 76.2,83.82 arc90 R3.P$2 arc90 93.98,83.82 104.14,83.82 arc90 R4.P$2 arc90 121.92,83.82 129.54,83.82 arc90 140.97,95.25 R5.P$2 arc90 149.86,83.82 162.56,83.82 arc90 R6.P$2 | R7.P$2 77.47,190.5 | R8.P$2 -1.27,177.8 arc90 15.24,161.29 48.26,161.29 arc90 77.47,190.5
  BoardWire 0.61: v31.75,26.67 26.67,26.67 arc90 22.86,22.86 22.86,10.16 arc90 v26.67,6.35
  Bottom 0.61: OK1.8 34.29,24.13 R25.P$1 v31.75,26.67 | B1.5V@0 v26.67,6.35 21.59,6.35 21.59,13.97 R27.P$1 | 5V.1 95.25,52.07 B1.5V@2
GND  (via drill 1.2)  (5 unrouted)
  Ground 0.61: P5.1 123.27,121.92 | 123.27,121.92 123.27,123.27 arc-90 129.54,129.54 144.78,129.54 arc-90 151.21,123.11 P6.1 arc90 147.32,117.39 147.32,111.76 arc90 152.4,106.68 arc-90 154.23,104.85 SW6.P$1 arc90 150.42,101.6 127,101.6 arc90 123.75,98.35 SW5.P$1 arc90 119.94,101.6 99.06,101.6 arc90 95.81,98.35 SW4.P$1 arc90 92,101.6 71.12,101.6 arc90 67.87,98.35 SW3.P$1 arc90 64.06,101.6 43.18,101.6 arc90 39.93,98.35 SW2.P$1 arc90 36.12,101.6 15.8,101.6 arc90 SW1.P$1 arc90 5.08,90.88 5.08,60.96 arc90 v13.97,49.53 | 123.27,121.92 arc90 115.65,129.54 103.58,129.54 arc90 P4.1 arc90 87.08,129.54 75.64,129.54 arc90 P3.1 arc90 59.13,129.54 47.7,129.54 arc90 P2.1 arc90 31.2,129.54 17.78,129.54 arc90 11.51,123.27 P1.1 arc-90 5.08,127.72 5.08,149.86 arc-90 8.89,153.67 LED1.K arc-90 20.32,157.48 41.27,157.48 arc-90 LED2.K 45.09,154.31 arc-90 48.26,157.48 68.58,157.48 arc-90 LED3.K arc-90 76.2,157.48 97.79,157.48 arc-90 LED4.K 101.6,154.94 arc-90 104.14,157.48 124.46,157.48 arc-90 LED5.K arc-90 132.08,157.48 153.67,157.48 arc-90 LED6.K arc-90 161.29,157.48 172.72,157.48 arc90 177.8,162.56 177.8,200.66 arc90 172.72,205.74 162,205.74 arc90 P8.1 153.75,199.31 arc90 147.32,205.74 134.06,205.74 arc90 P7.1 arc-90 121.36,193.04 106.68,193.04 arc90 DRIGHT.3 | DRIGHT.3 DRIGHT.8 arc-90 96.52,198.12 86.36,198.12 arc-90 DLEFT.8 | DRIGHT.3 arc90 96.52,190.5 86.36,190.5 arc90 DLEFT.3 82.55,189.23 arc90 76.2,195.58 66.6,195.58 arc90 SW7.P$1 | SW7.P$1 59.69,189.23 arc-90 58.42,190.5 58.42,200.66 arc-90 LED7.K | SW7.P$1 39.34,189.23 arc-90 S1.A 36.5,193.37 arc90 35.56,194.31 26.67,194.31 arc-90 -2.54,198.12 -2.54,203.2 arc90 -5.08,205.74 -12.06,205.74 arc90 -14.61,203.2 -14.61,201.29
  Ground 0.61: -14.61,201.29 RGB.2 | SW8.P$1 -18.49,201.22 arc-90 -16.51,203.2 arc-90 -14.61,201.29 | v3.81,13.97 arc90 7.62,10.16 25.4,10.16 arc-90 v29.21,6.35
  Bottom 0.61: JA.SLEEVE C1.2 v13.97,49.53 13.97,52.07 | B1.GND@1 R26.P$2 26.67,13.97 OK1.5 | MIDI_OUT.1 arc-90 3.81,6.41 v3.81,13.97 | B1.GND@0 v29.21,6.35 | GND.1 97.79,21.59 97.79,6.35 85.09,6.35 B1.GND@3
JB1  (1 unrouted)
  SolderOnComponent 0.61: SW1.P$2 R1.P$1
  Buttons 0.61: R1.P$1 20.95,81.92 36.83,66.04 167.64,66.04
  Bottom 0.61: JB1.1 B1.22
JB2  (1 unrouted)
  SolderOnComponent 0.61: SW2.P$2 R2.P$1
  Buttons 0.61: R2.P$1 49.53,81.28 62.23,68.58 167.64,68.58
  Bottom 0.61: JB2.1 B1.23
JB3  (1 unrouted)
  SolderOnComponent 0.61: SW3.P$2 R3.P$1
  Buttons 0.61: R3.P$1 78.74,96.52 78.74,81.28 88.9,71.12 167.64,71.12
  Bottom 0.61: B1.24 JB3.1
JB4  (1 unrouted)
  SolderOnComponent 0.61: SW4.P$2 R4.P$1
  Buttons 0.61: SW4.P$2 102.87,97.23 102.87,81.28 110.49,73.66 167.64,73.66
  Bottom 0.61: B1.25 JB4.1
JB5  (1 unrouted)
  SolderOnComponent 0.61: SW5.P$2 R5.P$1
  Buttons 0.61: SW5.P$2 131.44,96.59 131.44,81.28 136.53,76.2 167.64,76.2
  Bottom 0.61: JB5.1 B1.26
JB6  (1 unrouted)
  SolderOnComponent 0.61: SW6.P$2 R6.P$1
  Buttons 0.61: SW6.P$2 160.66,97.72 160.66,81.92 163.19,79.38 167.64,79.38
  Bottom 0.61: JB6.1 B1.27
JB7  (1 unrouted)
  SolderOnComponent 0.61: R7.P$1 SW7.P$2
  Buttons 0.61: R7.P$1 69.85,162.56 67.31,160.02 7.62,160.02 -2.54,144.78 -2.54,81.28 15.24,63.5 167.64,63.5
  Bottom 0.61: JB7.1 B1.28
JB8  (1 unrouted)
  SolderOnComponent 0.61: SW8.P$2 R8.P$1
  Buttons 0.61: R8.P$1 -9.53,188.59 -9.53,152.4 -5.08,147.96 -5.08,78.74 12.7,60.96 167.64,60.96
  Bottom 0.61: B1.29 JB8.1
JL1  (1 unrouted)
  LEDS 0.406: LED1.A 35.56,137.16 167.64,137.16
  Bottom 0.61: JLED1.1 B1.17
JL2  (1 unrouted)
  LEDS 0.406: LED2.A 47.62,153.03 60.96,139.7 167.64,139.7
  Bottom 0.61: JLED2.1 B1.16
JL3  (1 unrouted)
  LEDS 0.406: LED3.A 86.36,142.24 167.64,142.24
  Bottom 0.61: JLED3.1 B1.6
JL4  (1 unrouted)
  LEDS 0.406: LED4.A 104.14,152.4 111.76,144.78 167.64,144.78
  Bottom 0.61: JLED4.1 B1.7
JL5  (1 unrouted)
  LEDS 0.406: LED5.A 137.16,147.32 167.64,147.32
  Bottom 0.61: JLED5.1 29.21,52.07 B1.8
JL6  (1 unrouted)
  LEDS 0.406: LED6.A 160.02,152.4 162.56,149.86 167.64,149.86
  Bottom 0.61: JLED6.1 26.67,52.07 B1.9
JL7  (1 unrouted)
  LEDS 0.406: LED7.A 62.23,199.39 63.5,198.12 68.58,198.12 68.58,228.6
  Bottom 0.61: JLED7.1 24.13,52.07 B1.10
JLB  (1 unrouted)
  LEDS 0.406: RGB.4 -17.14,236.85
  Bottom 0.61: JLEDB.1 B1.2
JLG  (1 unrouted)
  LEDS 0.406: RGB.3 -15.88,230.5
  Bottom 0.61: JLEDG.1 B1.3
JLR  (1 unrouted)
  LEDS 0.406: RGB.1 -13.34,225.43
  Bottom 0.61: JLEDR.1 B1.5
JP1  (1 unrouted)
  Potentiometers 0.406: P1.2 16.51,120.65 33.02,104.14 177.8,104.14
  Bottom 0.61: B1.A0 JP1.1
JP2  (1 unrouted)
  Potentiometers 0.406: P2.2 44.45,120.65 58.42,106.68 177.8,106.68
  Bottom 0.61: B1.A1 JP2.1
JP3  (1 unrouted)
  Potentiometers 0.406: P3.2 72.39,120.65 83.82,109.22 177.8,109.22
  Bottom 0.61: B1.A2 JP3.1
JP4  (1 unrouted)
  Potentiometers 0.406: P4.2 100.33,120.65 109.22,111.76 177.8,111.76
  Bottom 0.61: B1.A3 JP4.1
JP5  (1 unrouted)
  Potentiometers 0.406: P5.2 128.27,120.65 134.62,114.3 177.8,114.3
  Bottom 0.61: B1.A4 JP5.1
JP6  (1 unrouted)
  Potentiometers 0.406: P6.2 156.21,120.65 160.02,116.84 177.8,116.84
  Bottom 0.61: B1.A5 JP6.1
JP7  (1 unrouted)
  Potentiometers 0.406: P7.2 130.81,196.85 147.32,180.34 195.58,180.34
  Bottom 0.61: B1.A6 JP7.1
JP8-2  (1 unrouted)
  Volume 0.61: P8.2 168.28,187.96 208.28,187.96
  Bottom 0.61: R23.P$1 R22.P$1 | R22.P$1 C1.1 | R22.P$1 R21.P$1 JP8-2.1
JP8-3  (1 unrouted)
  Volume 0.61: P8.3 170.74,190.5 208.28,190.5
  Bottom 0.61: JA.TIP JP8-3.1
JS1  (1 unrouted)
  RotSwitch 0.406: R9.P$2 35.56,170.18 24.77,170.18 17.78,177.16 17.78,259.08
  Bottom 0.61: B1.37 JS1.1
JS2  (1 unrouted)
  RotSwitch 0.406: R10.P$2 24.13,173.99 20.32,178.44 20.32,252.73
  Bottom 0.61: B1.36 JS2.1
JS3  (1 unrouted)
  RotSwitch 0.406: R11.P$2 25.4,176.53 22.86,179.07 22.86,248.92
  Bottom 0.61: B1.35 JS3.1
JS4  (1 unrouted)
  RotSwitch 0.406: R12.P$2 26.67,244.47
  Bottom 0.61: JS4.1 B1.34
JS5  (1 unrouted)
  RotSwitch 0.406: R13.P$2 31.75,241.3
  Bottom 0.61: B1.33 JS5.1
JS6  (1 unrouted)
  RotSwitch 0.406: R14.P$2 36.83,236.22
  Bottom 0.61: JS6.1 B1.32
JS7  (1 unrouted)
  RotSwitch 0.406: R15.P$2 41.91,230.5
  Bottom 0.61: B1.31 JS7.1
JS8  (1 unrouted)
  RotSwitch 0.406: R16.P$2 46.99,225.43
  Bottom 0.61: JS8.1 B1.30
JS9  (1 unrouted)
  RotSwitch 0.406: R17.P$2 52.07,220.98
  Bottom 0.61: JS9.1 B1.21
JS10  (1 unrouted)
  RotSwitch 0.406: R18.P$2 52.07,173.99 40.64,162.56 20.32,162.56 10.16,172.72 10.16,274.32
  Bottom 0.61: JS10.1 B1.20
JS11  (1 unrouted)
  RotSwitch 0.406: R19.P$2 46.99,171.45 40.64,165.1 20.32,165.1 12.7,172.72 12.7,269.24
  Bottom 0.61: JS11.1 B1.19
JS12  (2 unrouted)
  RotSwitch 0.406: R20.P$2 41.91,168.91 38.1,167.64 22.23,167.64 15.24,174.62 15.24,264.16
  Bottom 0.61: JS12.1 B1.18
LA  (1 unrouted)
  Display 0.61: DLEFT.7 90.17,226.06
  Bottom 0.61: B1.A8 LA.1
LB  (1 unrouted)
  Display 0.61: DLEFT.6 92.71,223.52
  Bottom 0.61: B1.A9 LB.1
LC  (1 unrouted)
  Display 0.61: DLEFT.4 90.17,170.18
  Bottom 0.61: B1.A10 LC.1
LD  (1 unrouted)
  Display 0.61: DLEFT.2 85.09,168.28
  Bottom 0.61: B1.A11 LD.1
LE  (1 unrouted)
  Display 0.61: DLEFT.1 82.55,165.1
  Bottom 0.61: B1.A12 LE.1
LF  (1 unrouted)
  Display 0.61: DLEFT.9 85.09,228.6
  Bottom 0.61: B1.A13 LF.1
LG  (1 unrouted)
  Display 0.61: DLEFT.10 82.55,231.14
  Bottom 0.61: B1.A14 LG.1
LP  (1 unrouted)
  Display 0.61: DLEFT.5 92.71,172.72
  Bottom 0.61: B1.A15 LP.1
MISO  (via drill 1.2)
  BoardWire 0.61: DO.1 arc-90 93.98,15.24 78.74,15.24 arc90 78.11,14.61 78.11,13.97 v80.01,13.97
  Bottom 0.61: v80.01,13.97 B1.50 | DO.1 v92.71,16.51
MOSI
  Bottom 0.61: DI.1 B1.51
MRX  (via drill 1.2)
  BoardWire 0.61: v36.83,19.05 arc90 52.07,34.29 v52.07,49.53
  Bottom 0.61: OK1.6 R25.P$2 v36.83,19.05 | v52.07,49.53 B1.0
MTX  (via drill 1.2)
  BoardWire 0.61: v19.05,6.35 arc90 21.59,8.89 21.59,27.94 arc-90 29.84,36.2 43.18,36.2 arc90 49.53,42.55 v49.53,49.53
  Bottom 0.61: MIDI_OUT.3 arc-90 13.91,6.35 v19.05,6.35 | v49.53,49.53 B1.1
MZ1
  Bottom 0.61: R23.P$2 21.59,52.07 B1.11
MZ2
  Bottom 0.61: R21.P$2 R22.P$2 19.05,52.07 B1.12
N$2
  SolderOnComponent 0.61: R9.P$1 arc-90 36.52,179.38 S1.1
N$3
  SolderOnComponent 0.61: S1.2 arc-90 31.75,187.02 R10.P$1
N$4
  SolderOnComponent 0.61: S1.3 arc90 28.57,191.92 R11.P$1
N$5
  SolderOnComponent 0.61: R12.P$1 26.67,199.87 arc90 S1.4
N$6
  SolderOnComponent 0.61: R13.P$1 arc90 31.6,205.59 S1.5
N$7
  SolderOnComponent 0.61: R14.P$1 arc90 36.52,209.25 S1.6
N$8
  SolderOnComponent 0.61: R15.P$1 arc-90 42.22,209.25 S1.7
N$9
  SolderOnComponent 0.61: R16.P$1 arc-90 47.14,206.86 S1.8
N$10
  SolderOnComponent 0.61: R17.P$1 arc90 49.99,199.85 S1.9
N$11
  SolderOnComponent 0.61: R18.P$1 arc-90 49.99,188.77 S1.10
N$12
  SolderOnComponent 0.61: R19.P$1 arc90 47.14,181.76 S1.11
N$13
  SolderOnComponent 0.61: R20.P$1 arc90 42.22,179.38 S1.12
N$25
  Bottom 0.61: MIDI_IN.3 13.97,19.13 D1.A OK1.3
N$28
  Bottom 0.61: R24.P$1 13.97,31.75 D1.C 13.97,21.59 OK1.2
N$29
  Bottom 0.61: MIDI_IN.2 R24.P$2
N$30
  Bottom 0.61: OK1.7 R26.P$1
N$31
  Bottom 0.61: R27.P$2 MIDI_OUT.2
RA  (1 unrouted)
  Display 0.61: DRIGHT.7 102.87,215.9
  Bottom 0.61: B1.49 RA.1
RB  (1 unrouted)
  Display 0.61: DRIGHT.6 105.41,213.36
  Bottom 0.61: B1.48 RB.1
RC  (1 unrouted)
  Display 0.61: DRIGHT.4 102.87,180.34
  Bottom 0.61: B1.47 RC.1
RD  (1 unrouted)
  Display 0.61: DRIGHT.2 97.79,177.8
  Bottom 0.61: B1.46 RD.1
RE  (1 unrouted)
  Display 0.61: DRIGHT.1 95.25,175.26
  Bottom 0.61: B1.45 RE.1
RF  (1 unrouted)
  Display 0.61: DRIGHT.9 97.79,218.44
  Bottom 0.61: B1.44 RF.1
RG  (1 unrouted)
  Display 0.61: DRIGHT.10 95.25,220.98
  Bottom 0.61: B1.43 RG.1
RP  (1 unrouted)
  Display 0.61: DRIGHT.5 105.41,182.88
  Bottom 0.61: B1.42 RP.1
SCK  (via drill 1.2)
  BoardWire 0.61: CLK.1 arc90 93.98,20.32 77.47,20.32 arc90 76.2,19.05 76.2,12.7 arc90 77.47,11.43 v80.01,11.43
  Bottom 0.61: v80.01,11.43 B1.52 | v92.71,19.05 CLK.1
SS
  Bottom 0.61: CS.1 B1.53

### Text on the board
Buttons: JB6 | JB5 | JB4 | JB3 | JB2 | JB1 | JB7 | JB8
Potentiometers: JP7 | JP6 | JP5 | JP4 | JP3 | JP2 | JP1
LEDS: JLEDB | JLEDG | JLED7 | JLEDR | JLED6 | JLED5 | JLED4 | JLED3 | JLED2 | JLED1
RotSwitch: JS10 | JS11 | JS12 | JS1 | JS2 | JS3 | JS4 | JS5 | JS6 | JS7 | JS8 | JS9
Volume: JP8-3 | JP8-2
Display: LG | LF | LA | LB | RG | RF | RA | RB | RP | RC | RD | RE | LP | LC | LD | LE